# EAGLE design Top_PCB (EAGLE 9.7.0)
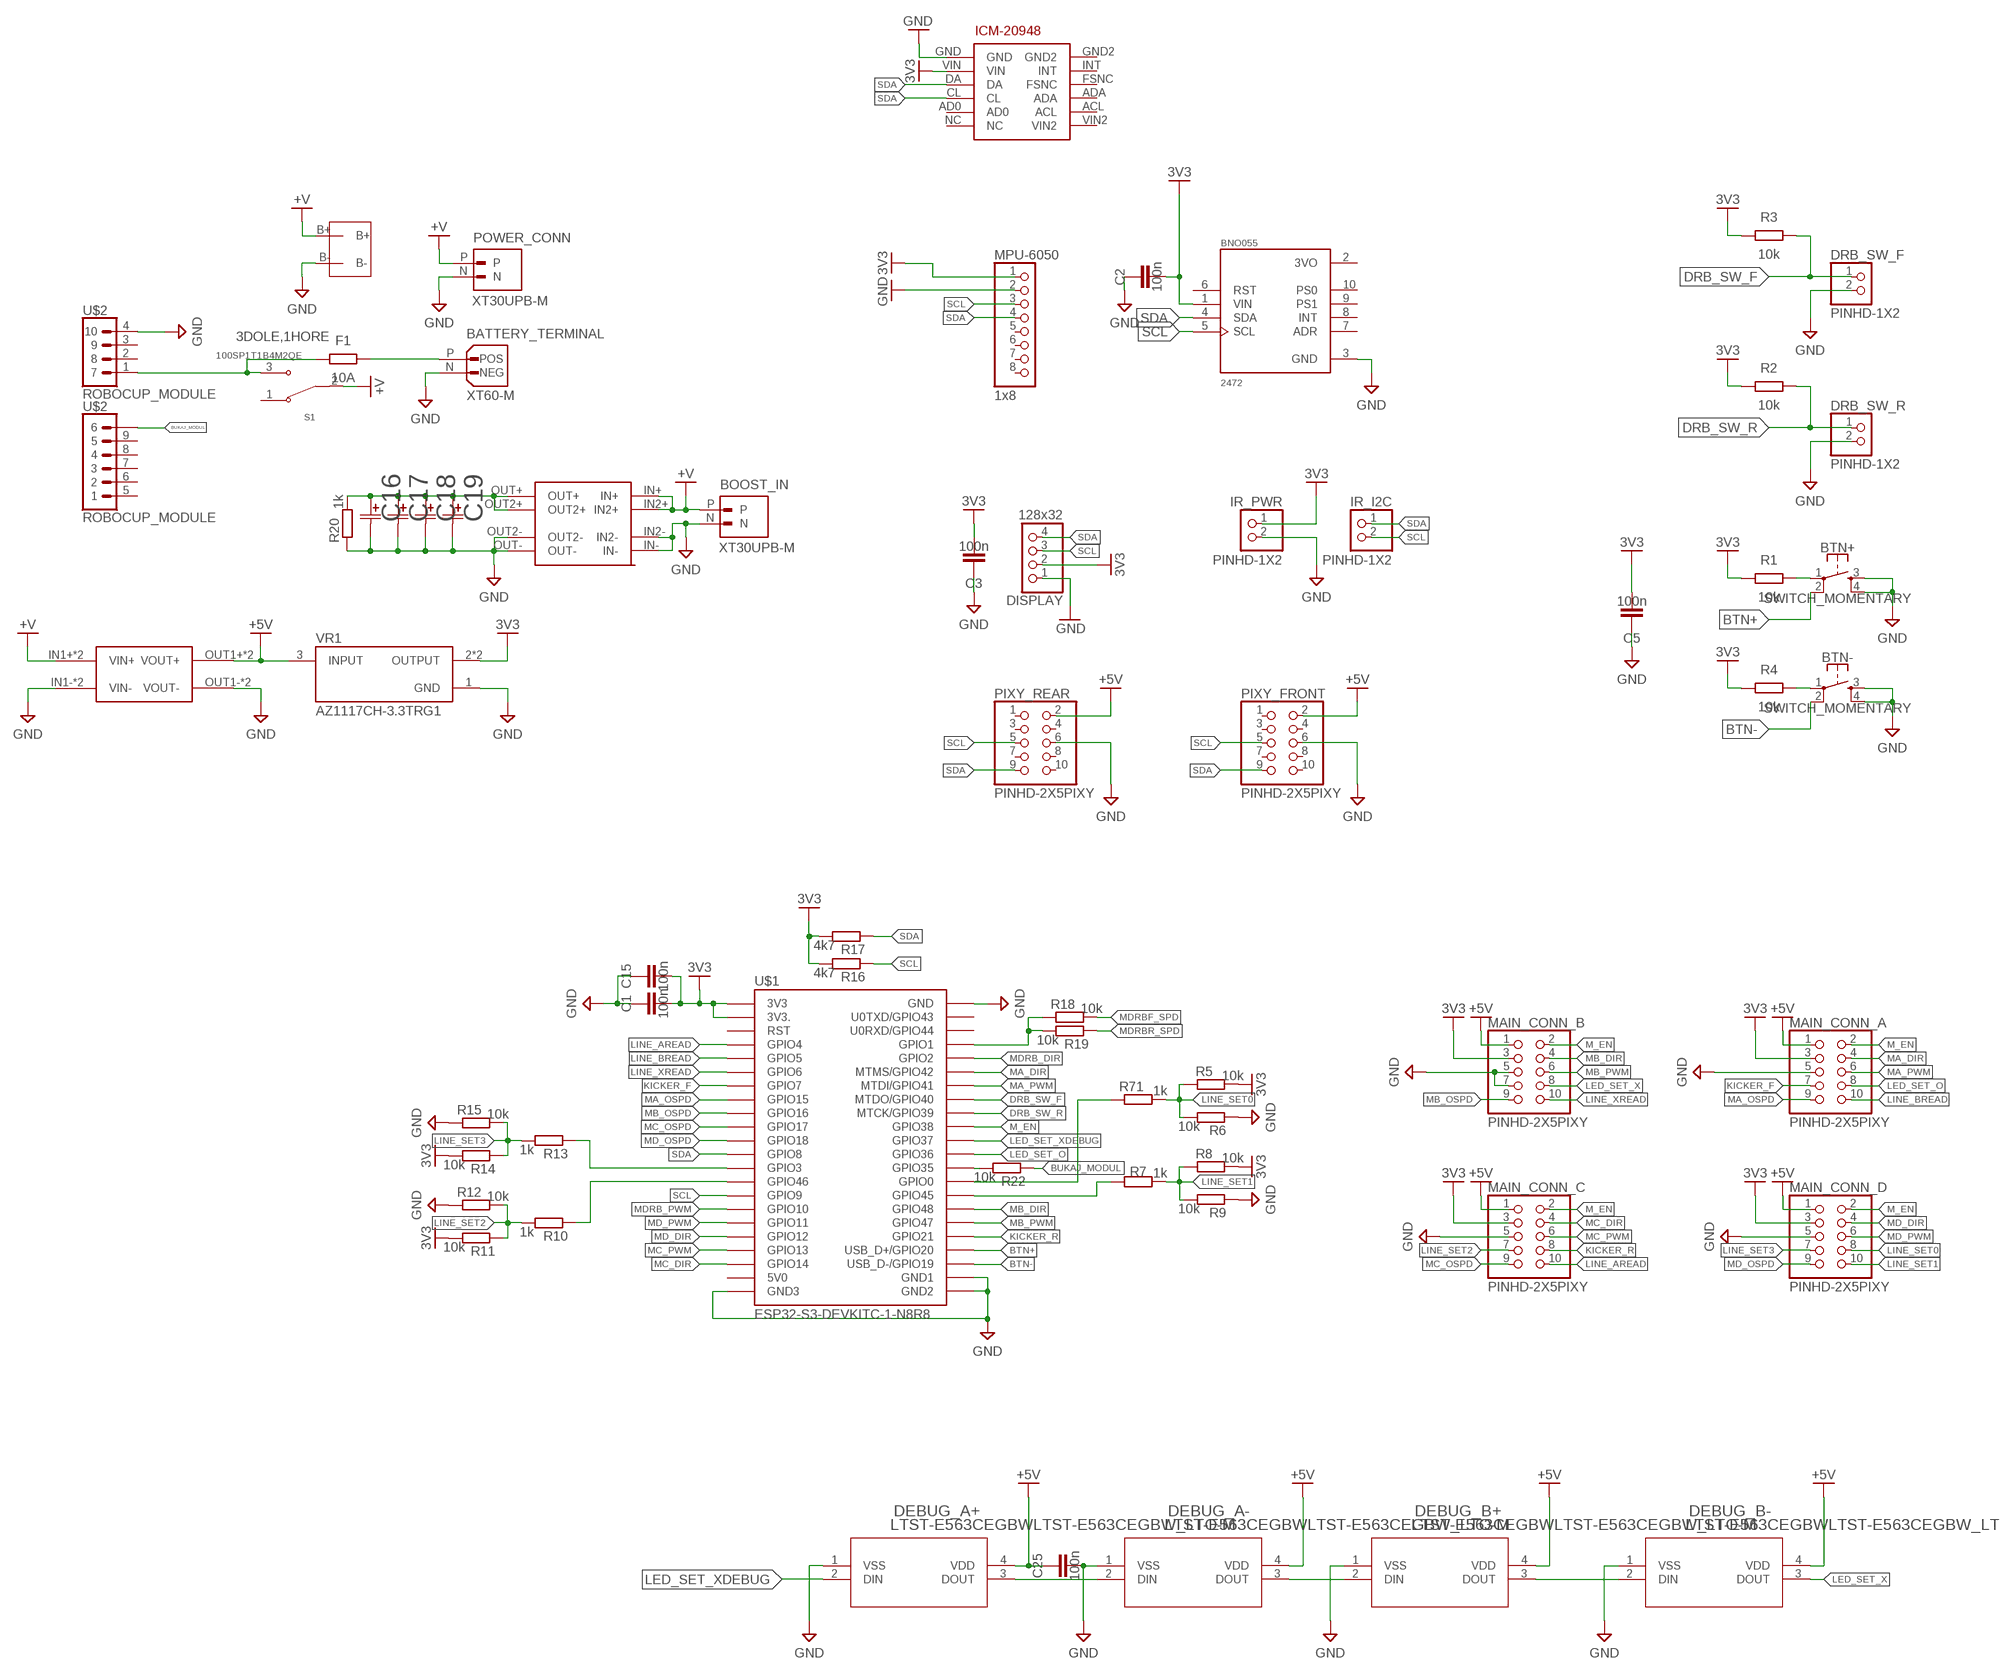
[diagram p0: schematic, sheet 1, part 1 of 2]
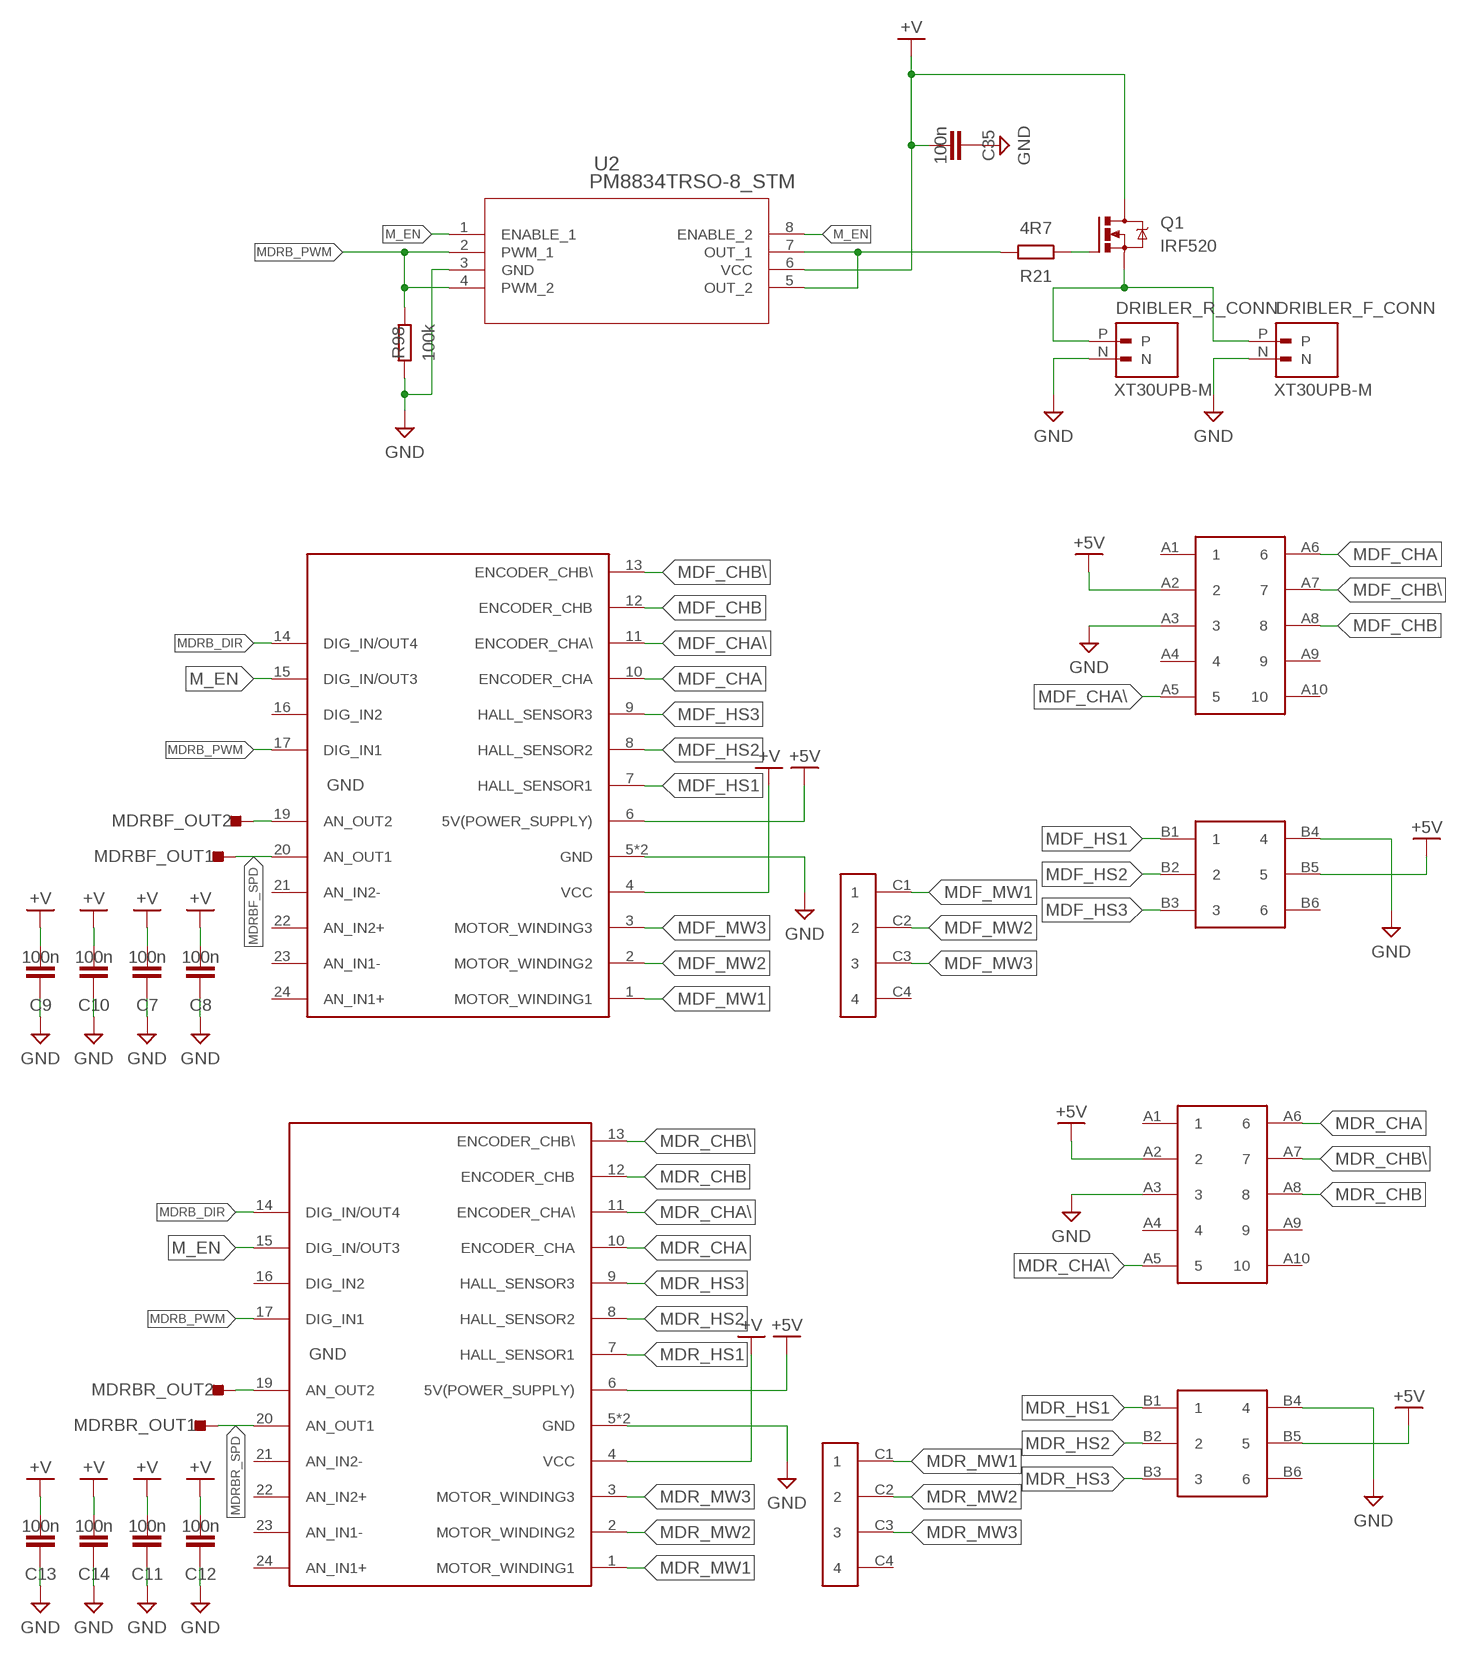
[diagram p1: schematic, sheet 1, part 2 of 2]

## Parts
BATT_VOLTAGE  BATT_V_METER  [1X02]
BATTERY_TERMINAL  XT60-M  [AMASS_XT60-M]
BNO055  2472  [MODULE_2472]
BOOST_IN  XT30UPB-M  [AMASS_XT30UPB-M]
BTN+  SWITCH_MOMENTARY  [SWITCH-MOMENTARY-PTH-6.5MM]
BTN-  SWITCH_MOMENTARY  [SWITCH-MOMENTARY-PTH-6.5MM]
C1  100n  C_CHIP-0805(2012-METRIC)  [CAPC2012X110]
C2  100n  C_CHIP-0805(2012-METRIC)  [CAPC2012X110]
C3  100n  C_CHIP-0805(2012-METRIC)  [CAPC2012X110]
C5  100n  C_CHIP-0805(2012-METRIC)  [CAPC2012X110]
C7  100n  C_CHIP-0805(2012-METRIC)  [CAPC2012X110]
C8  100n  C_CHIP-0805(2012-METRIC)  [CAPC2012X110]
C9  100n  C_CHIP-0805(2012-METRIC)  [CAPC2012X110]
C10  100n  C_CHIP-0805(2012-METRIC)  [CAPC2012X110]
C11  100n  C_CHIP-0805(2012-METRIC)  [CAPC2012X110]
C12  100n  C_CHIP-0805(2012-METRIC)  [CAPC2012X110]
C13  100n  C_CHIP-0805(2012-METRIC)  [CAPC2012X110]
C14  100n  C_CHIP-0805(2012-METRIC)  [CAPC2012X110]
C15  100n  C_CHIP-0805(2012-METRIC)  [CAPC2012X110]
C16  1mF  108CKE063MCAP_108CKE_ILC  [CAP_108CKE_ILC]
C17  1mF  108CKE063MCAP_108CKE_ILC  [CAP_108CKE_ILC]
C18  1mF  108CKE063MCAP_108CKE_ILC  [CAP_108CKE_ILC]
C19  1mF  108CKE063MCAP_108CKE_ILC  [CAP_108CKE_ILC]
C25  100n  C_CHIP-0805(2012-METRIC)  [CAPC2012X110]
C35  100n  C_CHIP-0805(2012-METRIC)  [CAPC2012X110]
DEBUG_A+  LTST-E563CEGBWLTST-E563CEGBW_LTO-M  [LTST-E563CEGBW_LTO-M]
DEBUG_A-  LTST-E563CEGBWLTST-E563CEGBW_LTO-M  [LTST-E563CEGBW_LTO-M]
DEBUG_B+  LTST-E563CEGBWLTST-E563CEGBW_LTO-M  [LTST-E563CEGBW_LTO-M]
DEBUG_B-  LTST-E563CEGBWLTST-E563CEGBW_LTO-M  [LTST-E563CEGBW_LTO-M]
DISPLAY  128x32  PINHD-1X4  [1X04]
DRB_SW_F  PINHD-1X2  [1X02]
DRB_SW_R  PINHD-1X2  [1X02]
DRIBLER_F_CONN  XT30UPB-M  [AMASS_XT30UPB-M]
DRIBLER_R_CONN  XT30UPB-M  [AMASS_XT30UPB-M]
F1  10A  R_CHIP-1206(3216-METRIC)  [RESC3216X70]
ICM-20948  ICM-20948  [ICM-20948]
IR_I2C  PINHD-1X2  [1X02]
IR_PWR  PINHD-1X2  [1X02]
MAIN_CONN_A  PINHD-2X5PIXY  [2X05]
MAIN_CONN_B  PINHD-2X5PIXY  [2X05]
MAIN_CONN_C  PINHD-2X5PIXY  [2X05]
MAIN_CONN_D  PINHD-2X5PIXY  [2X05]
MDRBF_OUT1  TESTPOINT_TPS-PAD-036  [TESTPOINT_PAD-036]
MDRBF_OUT2  TESTPOINT_TPS-PAD-036  [TESTPOINT_PAD-036]
MDRBR_OUT1  TESTPOINT_TPS-PAD-036  [TESTPOINT_PAD-036]
MDRBR_OUT2  TESTPOINT_TPS-PAD-036  [TESTPOINT_PAD-036]
MPU-6050  1x8  PINHD-1X8  [1X08]
PIXY_FRONT  PINHD-2X5PIXY  [2X05]
PIXY_REAR  PINHD-2X5PIXY  [2X05]
POWER_CONN  XT30UPB-M  [AMASS_XT30UPB-M]
Q1  IRF520  NMOSFET_IRF520_TO220  [TO220BV]
R1  10k  R_CHIP-0805(2012-METRIC)  [RESC2012X65]
R2  10k  R_CHIP-0805(2012-METRIC)  [RESC2012X65]
R3  10k  R_CHIP-0805(2012-METRIC)  [RESC2012X65]
R4  10k  R_CHIP-0805(2012-METRIC)  [RESC2012X65]
R5  10k  R_CHIP-0805(2012-METRIC)  [RESC2012X65]
R6  10k  R_CHIP-0805(2012-METRIC)  [RESC2012X65]
R7  1k  R_CHIP-0805(2012-METRIC)  [RESC2012X65]
R8  10k  R_CHIP-0805(2012-METRIC)  [RESC2012X65]
R9  10k  R_CHIP-0805(2012-METRIC)  [RESC2012X65]
R10  1k  R_CHIP-0805(2012-METRIC)  [RESC2012X65]
R11  10k  R_CHIP-0805(2012-METRIC)  [RESC2012X65]
R12  10k  R_CHIP-0805(2012-METRIC)  [RESC2012X65]
R13  1k  R_CHIP-0805(2012-METRIC)  [RESC2012X65]
R14  10k  R_CHIP-0805(2012-METRIC)  [RESC2012X65]
R15  10k  R_CHIP-0805(2012-METRIC)  [RESC2012X65]
R16  4k7  R_CHIP-0805(2012-METRIC)  [RESC2012X65]
R17  4k7  R_CHIP-0805(2012-METRIC)  [RESC2012X65]
R18  10k  R_CHIP-0805(2012-METRIC)  [RESC2012X65]
R19  10k  R_CHIP-0805(2012-METRIC)  [RESC2012X65]
R20  1k  R_CHIP-0805(2012-METRIC)  [RESC2012X65]
R21  4R7  R_CHIP-0805(2012-METRIC)  [RESC2012X65]
R22  10k  R_CHIP-0805(2012-METRIC)  [RESC2012X65]
R71  1k  R_CHIP-0805(2012-METRIC)  [RESC2012X65]
R98  100k  R_CHIP-0805(2012-METRIC)  [RESC2012X65]
S1  100SP1T1B4M2QE  [SW_100SP1T1B4M2QE]
U2  PM8834TRSO-8_STM  [SO-8_STM]
U$1  ESP32-S3-DEVKITC-1-N8R8  [ESP32-S3-DEVKITC-1-N8R8]
U$2  ROBOCUP_MODULE  [ROBOCUP_MODULE]
U$4  MP1584  [DC-BRICK]
U$5  BOOST  [BOOST]
U$7  ESCON24/224/2  [ESCON24/2]
U$8  PIN2.54-2X5  [PIN2.54-2X5]
U$9  ESCON24/224/2  [ESCON24/2]
U$10  MX-44914-0601  [MX-44914-0601]
U$11  PIN2.54-2X5  [PIN2.54-2X5]
U$12  MX-44914-0601  [MX-44914-0601]
U$13  MX5566  [MX5566]
U$14  MX5566  [MX5566]
VR1  AZ1117CH-3.3TRG1  [VREG_AZ1117CH-3.3TRG1]

## Nets
3DOLE,1HORE: F1.1 S1.3 U$2.1
3V3: BNO055.1(VIN) C1.2 C2.2 C3.2 C5.2 C15.2 DISPLAY.2 ICM-20948.VIN IR_PWR.1 MAIN_CONN_A.3 MAIN_CONN_B.3 MAIN_CONN_C.3 MAIN_CONN_D.3 MPU-6050.1 R1.1 R2.1 R3.1 R4.1 R5.1 R8.1 R11.1 R14.1 R16.1 R17.1 U$1.J1_1(3V3) U$1.J1_2(3V3.) VR1.2(OUTPUT) VR1.4(OUTPUT)
+5V: C25.1 DEBUG_A+.4(VDD) DEBUG_A-.4(VDD) DEBUG_B+.4(VDD) DEBUG_B-.4(VDD) MAIN_CONN_A.1 MAIN_CONN_B.1 MAIN_CONN_C.1 MAIN_CONN_D.1 PIXY_FRONT.2 PIXY_REAR.2 U$4.OUT1+(VOUT+) U$4.OUT2+(VOUT+) U$7.6(5V(POWER_SUPPLY)) U$8.A2 U$9.6(5V(POWER_SUPPLY)) U$10.B5 U$11.A2 U$12.B5 VR1.3(INPUT)
+V: BATT_VOLTAGE.B+ BOOST_IN.P C7.2 C8.2 C9.2 C10.2 C11.2 C12.2 C13.2 C14.2 C35.2 POWER_CONN.P Q1.D S1.2 U2.6(VCC) U$4.IN1+(VIN+) U$4.IN2+(VIN+) U$5.IN2+ U$5.IN+ U$7.4(VCC) U$9.4(VCC)
BTN+: BTN+.2 U$1.J3_19(USB_D+/GPIO20)
BTN-: BTN-.2 U$1.J3_20(USB_D-/GPIO19)
BUKAJ_MODUL: R22.2 U$2.10
DRB_SW_F: DRB_SW_F.1 R3.2 U$1.J3_8(MTDO/GPIO40)
DRB_SW_R: DRB_SW_R.1 R2.2 U$1.J3_9(MTCK/GPIO39)
GND: BATT_VOLTAGE.B- BATTERY_TERMINAL.N(NEG) BNO055.3(GND) BOOST_IN.N BTN+.3 BTN+.4 BTN-.3 BTN-.4 C1.1 C2.1 C3.1 C5.1 C7.1 C8.1 C9.1 C10.1 C11.1 C12.1 C13.1 C14.1 C15.1 C16.2 C17.2 C18.2 C19.2 C25.2 C35.1 DEBUG_A+.1(VSS) DEBUG_A-.1(VSS) DEBUG_B+.1(VSS) DEBUG_B-.1(VSS) DISPLAY.1 DRB_SW_F.2 DRB_SW_R.2 DRIBLER_F_CONN.N DRIBLER_R_CONN.N ICM-20948.GND IR_PWR.2 MAIN_CONN_A.5 MAIN_CONN_B.5 MAIN_CONN_B.7 MAIN_CONN_C.5 MAIN_CONN_D.5 MPU-6050.2 PIXY_FRONT.6 PIXY_REAR.6 POWER_CONN.N R6.2 R9.2 R12.2 R15.2 R20.2 R98.1 U2.3(GND) U$1.J1_22(GND3) U$1.J3_1(GND) U$1.J3_21(GND1) U$1.J3_22(GND2) U$2.4 U$4.IN1-(VIN-) U$4.IN2-(VIN-) U$4.OUT1-(VOUT-) U$4.OUT2-(VOUT-) U$5.IN2- U$5.IN- U$5.OUT2- U$5.OUT- U$7.5(GND) U$7.18(GND) U$8.A3 U$9.5(GND) U$9.18(GND) U$10.B4 U$11.A3 U$12.B4 VR1.1(GND)
KICKER_F: MAIN_CONN_A.7 U$1.J1_7(GPIO7)
KICKER_R: MAIN_CONN_C.8 U$1.J3_18(GPIO21)
LED_SET_DEBUG1: DEBUG_A-.3(DOUT) DEBUG_B+.2(DIN)
LED_SET_O: MAIN_CONN_A.8 U$1.J3_12(GPIO36)
LED_SET_X: DEBUG_B-.3(DOUT) MAIN_CONN_B.8
LED_SET_XDEBUG: DEBUG_A+.2(DIN) U$1.J3_11(GPIO37)
LINE_AREAD: MAIN_CONN_C.10 U$1.J1_4(GPIO4)
LINE_BREAD: MAIN_CONN_A.10 U$1.J1_5(GPIO5)
LINE_SET0: MAIN_CONN_D.8 R5.2 R6.1 R71.1
LINE_SET1: MAIN_CONN_D.10 R7.1 R8.2 R9.1
LINE_SET2: MAIN_CONN_C.7 R10.1 R11.2 R12.1
LINE_SET3: MAIN_CONN_D.7 R13.1 R14.2 R15.1
LINE_XREAD: MAIN_CONN_B.10 U$1.J1_6(GPIO6)
M_EN: MAIN_CONN_A.2 MAIN_CONN_B.2 MAIN_CONN_C.2 MAIN_CONN_D.2 U2.1(ENABLE_1) U2.8(ENABLE_2) U$1.J3_10(GPIO38) U$7.15(DIG_IN/OUT3) U$9.15(DIG_IN/OUT3)
MA_DIR: MAIN_CONN_A.4 U$1.J3_6(MTMS/GPIO42)
MA_OSPD: MAIN_CONN_A.9 U$1.J1_8(GPIO15)
MA_PWM: MAIN_CONN_A.6 U$1.J3_7(MTDI/GPIO41)
MB_DIR: MAIN_CONN_B.4 U$1.J3_16(GPIO48)
MB_OSPD: MAIN_CONN_B.9 U$1.J1_9(GPIO16)
MB_PWM: MAIN_CONN_B.6 U$1.J3_17(GPIO47)
MC_DIR: MAIN_CONN_C.4 U$1.J1_20(GPIO14)
MC_OSPD: MAIN_CONN_C.9 U$1.J1_10(GPIO17)
MC_PWM: MAIN_CONN_C.6 U$1.J1_19(GPIO13)
MD_DIR: MAIN_CONN_D.4 U$1.J1_18(GPIO12)
MD_OSPD: MAIN_CONN_D.9 U$1.J1_11(GPIO18)
MD_PWM: MAIN_CONN_D.6 U$1.J1_17(GPIO11)
MDF_CHA: U$9.10(ENCODER_CHA) U$11.A6
MDF_CHA\\: U$9.11(ENCODER_CHA\\) U$11.A5
MDF_CHB: U$9.12(ENCODER_CHB) U$11.A8
MDF_CHB\\: U$9.13(ENCODER_CHB\\) U$11.A7
MDF_HS1: U$9.7(HALL_SENSOR1) U$12.B1
MDF_HS2: U$9.8(HALL_SENSOR2) U$12.B2
MDF_HS3: U$9.9(HALL_SENSOR3) U$12.B3
MDF_MW1: U$9.1(MOTOR_WINDING1) U$13.C1
MDF_MW2: U$9.2(MOTOR_WINDING2) U$13.C2
MDF_MW3: U$9.3(MOTOR_WINDING3) U$13.C3
MDR_CHA: U$7.10(ENCODER_CHA) U$8.A6
MDR_CHA\\: U$7.11(ENCODER_CHA\\) U$8.A5
MDR_CHB: U$7.12(ENCODER_CHB) U$8.A8
MDR_CHB\\: U$7.13(ENCODER_CHB\\) U$8.A7
MDR_HS1: U$7.7(HALL_SENSOR1) U$10.B1
MDR_HS2: U$7.8(HALL_SENSOR2) U$10.B2
MDR_HS3: U$7.9(HALL_SENSOR3) U$10.B3
MDR_MW1: U$7.1(MOTOR_WINDING1) U$14.C1
MDR_MW2: U$7.2(MOTOR_WINDING2) U$14.C2
MDR_MW3: U$7.3(MOTOR_WINDING3) U$14.C3
MDRB_DIR: U$1.J3_5(GPIO2) U$7.14(DIG_IN/OUT4) U$9.14(DIG_IN/OUT4)
MDRB_PWM: R98.2 U2.2(PWM_1) U2.4(PWM_2) U$1.J1_16(GPIO10) U$7.17(DIG_IN1) U$9.17(DIG_IN1)
MDRB_SPD: R18.2 R19.1 U$1.J3_4(GPIO1)
MDRBF_SPD: MDRBF_OUT1.1(TP) R18.1 U$9.20(AN_OUT1)
MDRBR_SPD: MDRBR_OUT1.1(TP) R19.2 U$7.20(AN_OUT1)
N$1: DEBUG_B+.3(DOUT) DEBUG_B-.2(DIN)
N$2: C16.1 C17.1 C18.1 C19.1 R20.1 U$5.OUT2+ U$5.OUT+
N$3: BATTERY_TERMINAL.P(POS) F1.2
N$4: Q1.G R21.1
N$6: R22.1 U$1.J3_13(GPIO35)
N$10: BTN+.1 R1.2
N$11: MDRBR_OUT2.1(TP) U$7.19(AN_OUT2)
N$13: BTN-.1 R4.2
N$15: R13.2 U$1.J1_13(GPIO3)
N$16: R71.2 U$1.J3_14(GPIO0)
N$24: DEBUG_A+.3(DOUT) DEBUG_A-.2(DIN)
N$32: DRIBLER_F_CONN.P DRIBLER_R_CONN.P Q1.S
N$35: R10.2 U$1.J1_14(GPIO46)
N$36: R7.2 U$1.J3_15(GPIO45)
N$51: R21.2 U2.5(OUT_2) U2.7(OUT_1)
N$52: MDRBF_OUT2.1(TP) U$9.19(AN_OUT2)
SCL: BNO055.5(SCL) DISPLAY.3 IR_I2C.2 MPU-6050.3 PIXY_FRONT.5 PIXY_REAR.5 R16.2 U$1.J1_15(GPIO9)
SDA: BNO055.4(SDA) DISPLAY.4 ICM-20948.CL ICM-20948.DA IR_I2C.1 MPU-6050.4 PIXY_FRONT.9 PIXY_REAR.9 R17.2 U$1.J1_12(GPIO8)
Unconnected: BNO055.6(RST) BNO055.7(ADR) BNO055.8(INT) BNO055.9(PS1) BNO055.10(PS0) ICM-20948.ACL ICM-20948.AD0 ICM-20948.ADA ICM-20948.FSNC ICM-20948.GND2 ICM-20948.INT ICM-20948.NC ICM-20948.VIN2 MPU-6050.5 MPU-6050.6 MPU-6050.7 MPU-6050.8 PIXY_FRONT.1 PIXY_FRONT.3 PIXY_FRONT.4 PIXY_FRONT.7 PIXY_FRONT.8 PIXY_FRONT.10 PIXY_REAR.1 PIXY_REAR.3 PIXY_REAR.4 PIXY_REAR.7 PIXY_REAR.8 PIXY_REAR.10 S1.1 U$1.J1_3(RST) U$1.J3_2(U0TXD/GPIO43) U$1.J3_3(U0RXD/GPIO44) U$2.2 U$2.3 U$2.5 U$2.6 U$2.7 U$2.8 U$2.9 U$7.16(DIG_IN2) U$7.21(AN_IN2-) U$7.22(AN_IN2+) U$7.23(AN_IN1-) U$7.24(AN_IN1+) U$8.A1 U$8.A4 U$8.A9 U$8.A10 U$9.16(DIG_IN2) U$9.21(AN_IN2-) U$9.22(AN_IN2+) U$9.23(AN_IN1-) U$9.24(AN_IN1+) U$10.B6 U$11.A1 U$11.A4 U$11.A9 U$11.A10 U$12.B6 U$13.C4 U$14.C4

## Power pins joined to a net without a drawn wire
3VO: BNO055.2(3VO)
5V0: U$1.J1_21(5V0)

## Library data of the parts
BATT_VOLTAGE = BATT_V_METER:BATT_V_METER
BATTERY_TERMINAL = XT60-M:XT60-M: Check availability <https://pricing.snapeda.com/parts/XT60-M/AMASS/view-part?ref=eda>; AVAILABILITY: In Stock; CHECK_PRICES: https://www.snapeda.com/parts/XT60-M/AMASS/view-part/?ref=eda; DESCRIPTION: Plug; DC supply; XT60; male; PIN: 2; for cable; soldered; 30A; 500V; MF: AMASS; MP: XT60-M; PACKAGE: Package; PRICE: None; SNAPEDA_LINK: https://www.snapeda.com/parts/XT60-M/AMASS/view-part/?ref=snap
BNO055 = 2472:2472: Check availability <https://pricing.snapeda.com/parts/2472/Adafruit/view-part?ref=eda>; AVAILABILITY: In Stock; CHECK_PRICES: https://www.snapeda.com/parts/2472/Adafruit+Industries/view-part/?ref=eda; DESCRIPTION: Adafruit 9-DOF Absolute Orientation IMU Fusion Breakout - BNO055 | Adafruit Industries 2472; MF: Adafruit; MP: 2472; PACKAGE: Non-Standard Adafruit; PRICE: None; PURCHASE-URL: https://www.snapeda.com/api/url_track_click_mouser/?unipart_id=6348449&manufacturer=Adafruit&part_name=2472&search_term=adafruit 9-dof; SNAPEDA_LINK: https://www.snapeda.com/parts/2472/Adafruit+Industries/view-part/?ref=snap
BOOST_IN DRIBLER_F_CONN DRIBLER_R_CONN POWER_CONN = XT30UPB-M:XT30UPB-M: Check availability <https://pricing.snapeda.com/parts/XT30UPB-M/amass/view-part?ref=eda>; AVAILABILITY: In Stock; CHECK_PRICES: https://www.snapeda.com/parts/XT30UPB-M/AMASS/view-part/?ref=eda; DESCRIPTION: Socket; DC supply; XT30; male; PIN: 2; on PCBs; THT; yellow; 15A; 500V; MF: amass; MP: XT30UPB-M; PACKAGE: None; PRICE: None; SNAPEDA_LINK: https://www.snapeda.com/parts/XT30UPB-M/AMASS/view-part/?ref=snap
BTN+ BTN- = Tinkercad:SWITCH_MOMENTARY
C1-C3 C5 C7-C15 C25 C35 = Capacitor:C: Capacitor - Generic; CATEGORY: Capacitor
C16-C19 = 2026-02-10_19-56-46_Library:108CKE063M; COPYRIGHT: Copyright (C) 2026 Ultra Librarian. All rights reserved.; MANUFACTURER_NAME: Cornell Dubilier; MANUFACTURER_PART_NUMBER: 108CKE063M; TYPE: Aluminum Electrolytic Capacitors
DEBUG_A+ DEBUG_A- DEBUG_B+ DEBUG_B- = 2025-12-23_15-34-03_Library:LTST-E563CEGBW; COPYRIGHT: Copyright (C) 2025 Ultra Librarian. All rights reserved.; MANUFACTURER_NAME: LITE-ON; MANUFACTURER_PART_NUMBER: LTST-E563CEGBW; TYPE: LED Addressable
DISPLAY = pinhead:PINHD-1X4: PIN HEADER
DRB_SW_F DRB_SW_R IR_I2C IR_PWR = Connector:PINHD-1X2: PIN HEADER; CATEGORY: Headers; DESCRIPTION: Header, Straight, 2 Position; MANUFACTURER: Generic; MPN: Generic; OPERATING_TEMPERATURE: Generic; PART_STATUS: Active; PITCH: 0.100" (2.54mm); ROHS_COMPLIANCE: Generic; SERIES: Generic; SUB-CATEGORY: Headers, Male Pins; TYPE: Board to Board or Cable, Unshrouded, Through Hole, Straight
F1 R1-R22 R71 R98 = Resistor:R: Resistor Fixed - Generic; CATEGORY: Resistor; SUB-CATEGORY: Fixed
ICM-20948 = ICM-20948:ICM-20948
MAIN_CONN_A MAIN_CONN_B MAIN_CONN_C MAIN_CONN_D PIXY_FRONT PIXY_REAR = Connector:PINHD-2X5PIXY: PIN HEADER; CATEGORY: CONNECTOR; SUB-CATEGORY: PIN-HEADER
MDRBF_OUT1 MDRBF_OUT2 MDRBR_OUT1 MDRBR_OUT2 = LinkedLibrary52101:TESTPOINT_TPS: TEST POINT PAD; BOM: EXCLUDE
MPU-6050 = pinhead:PINHD-1X8: PIN HEADER
Q1 = Transistor:NMOSFET_: N-Channel MOSFET - Popular parts; CATEGORY: Transistor; DESCRIPTION: MOSFET N-CH 100V 9.7A TO-220AB; DRAIN_CURRENT: 9.7A; MANUFACTURER: Infineon Technologies; MPN: IRF520NPBF; OPERATING_TEMP: -55°C ~ 175°C; PART_STATUS: Active; ROHS_COMPLIANT: Yes; SUB-CATEGORY: MOSFET; THERMALLOSS: 48W; TYPE: N-Channel
S1 = 100SP1T1B4M2QE:100SP1T1B4M2QE; MANUFACTURER: E-Switch; MAXIMUM_PACKAGE_HEIGHT: 29.68 mm; PARTREV: E; STANDARD: Manufacturer Recommendations
U2 = 2025-12-28_13-06-10_Library:PM8834TR; COPYRIGHT: Copyright (C) 2025 Ultra Librarian. All rights reserved.; DATASHEET: https://www.st.com/resource/en/datasheet/pm8834.pdf; DESCRIPTION: 4 A dual low side MOSFET driver; MANUFACTURER_NAME: STMicroelectronics; MANUFACTURER_PART_NUMBER: PM8834TR
U$1 = ESP32-S3-DEVKITC-1-N8R8 (1):ESP32-S3-DEVKITC-1-N8R8: Check availability <https://pricing.snapeda.com/parts/ESP32-S3-DEVKITC-1-N8R8/Espressif%20Systems/view-part?ref=eda>; AVAILABILITY: In Stock; CHECK_PRICES: https://www.snapeda.com/parts/ESP32-S3-DEVKITC-1-N8R8/Espressif+Systems/view-part/?ref=eda; DESCRIPTION: The ESP32-S3-DEVKITC-1-N8R8 from Espressif Systems is a development board designed for RF, RFID, and wireless applications. It supports 802.11 b/g/n Wi-Fi and Bluetooth® 5.x (BLE) connectivity at 2.4GHz, making it ideal for IoT and wireless communication projects. This board is powered by the ESP32-S3-WROOM-1-N8R8 module, which features 8MB Quad SPI Flash and 8MB Octal SPI for efficient memory storage and processing.; MF: Espressif Systems; MP: ESP32-S3-DEVKITC-1-N8R8; PACKAGE: None; PRICE: None; PURCHASE-URL: https://www.snapeda.com/api/url_track_click_mouser/?unipart_id=8940048&manufacturer=Espressif Systems&part_name=ESP32-S3-DEVKITC-1-N8R8&search_term=esp32 s3; SNAPEDA_LINK: https://www.snapeda.com/parts/ESP32-S3-DEVKITC-1-N8R8/Espressif+Systems/view-part/?ref=snap; SPICEPREFIX: X
U$2 = ROBOCUP_MODULE:ROBOCUP_MODULE
U$4 = MP1584-dc-brick:MP1584: MP1584-dc-brick-pcb Step down Input: 4.5V - 28V Ouput 0.8V - 25V max. 3A Cheap on ebay
U$5 = BOOST:BOOST
U$7 U$9 = ESCON_24-2:ESCON24/2
U$8 U$11 = PIN2.54-2X5:PIN2.54-2X5: Connector for EC-FLAT45(encoder): Can be bought at gme.sk: https://www.gme.sk/v/1498388/kls-mlw10g-konektor-vidlice-roztec-254mm-2x5pinov-priama-do-dps
U$10 U$12 = MX-44914-0601:MX-44914-0601: Connector for EC-FLAT45(hall sensor): Can be bought trough tme.eu: https://www.tme.eu/gb/details/mx-44914-0601/other-connectors-molex/molex/449140601/
U$13 U$14 = MX5566:MX5566: Connector for EC-FLAT45(motor windings): Can be bought on gme.sk: https://www.gme.sk/v/1496575/molex-39-28-1043-mini-fit-vidlica-rozstup-42mm-2x2piny-priama-do-dps
VR1 = AZ1117CH-3.3TRG1:AZ1117CH-3.3TRG1; CREATOR: ASHISH; MANUFACTURER: Diodes Inc.; MAXIMUM_PACKAGE_HEIGHT: 1.8mm; PARTREV: 5 - 2; STANDARD: Manufacturer Recommendations

## Board
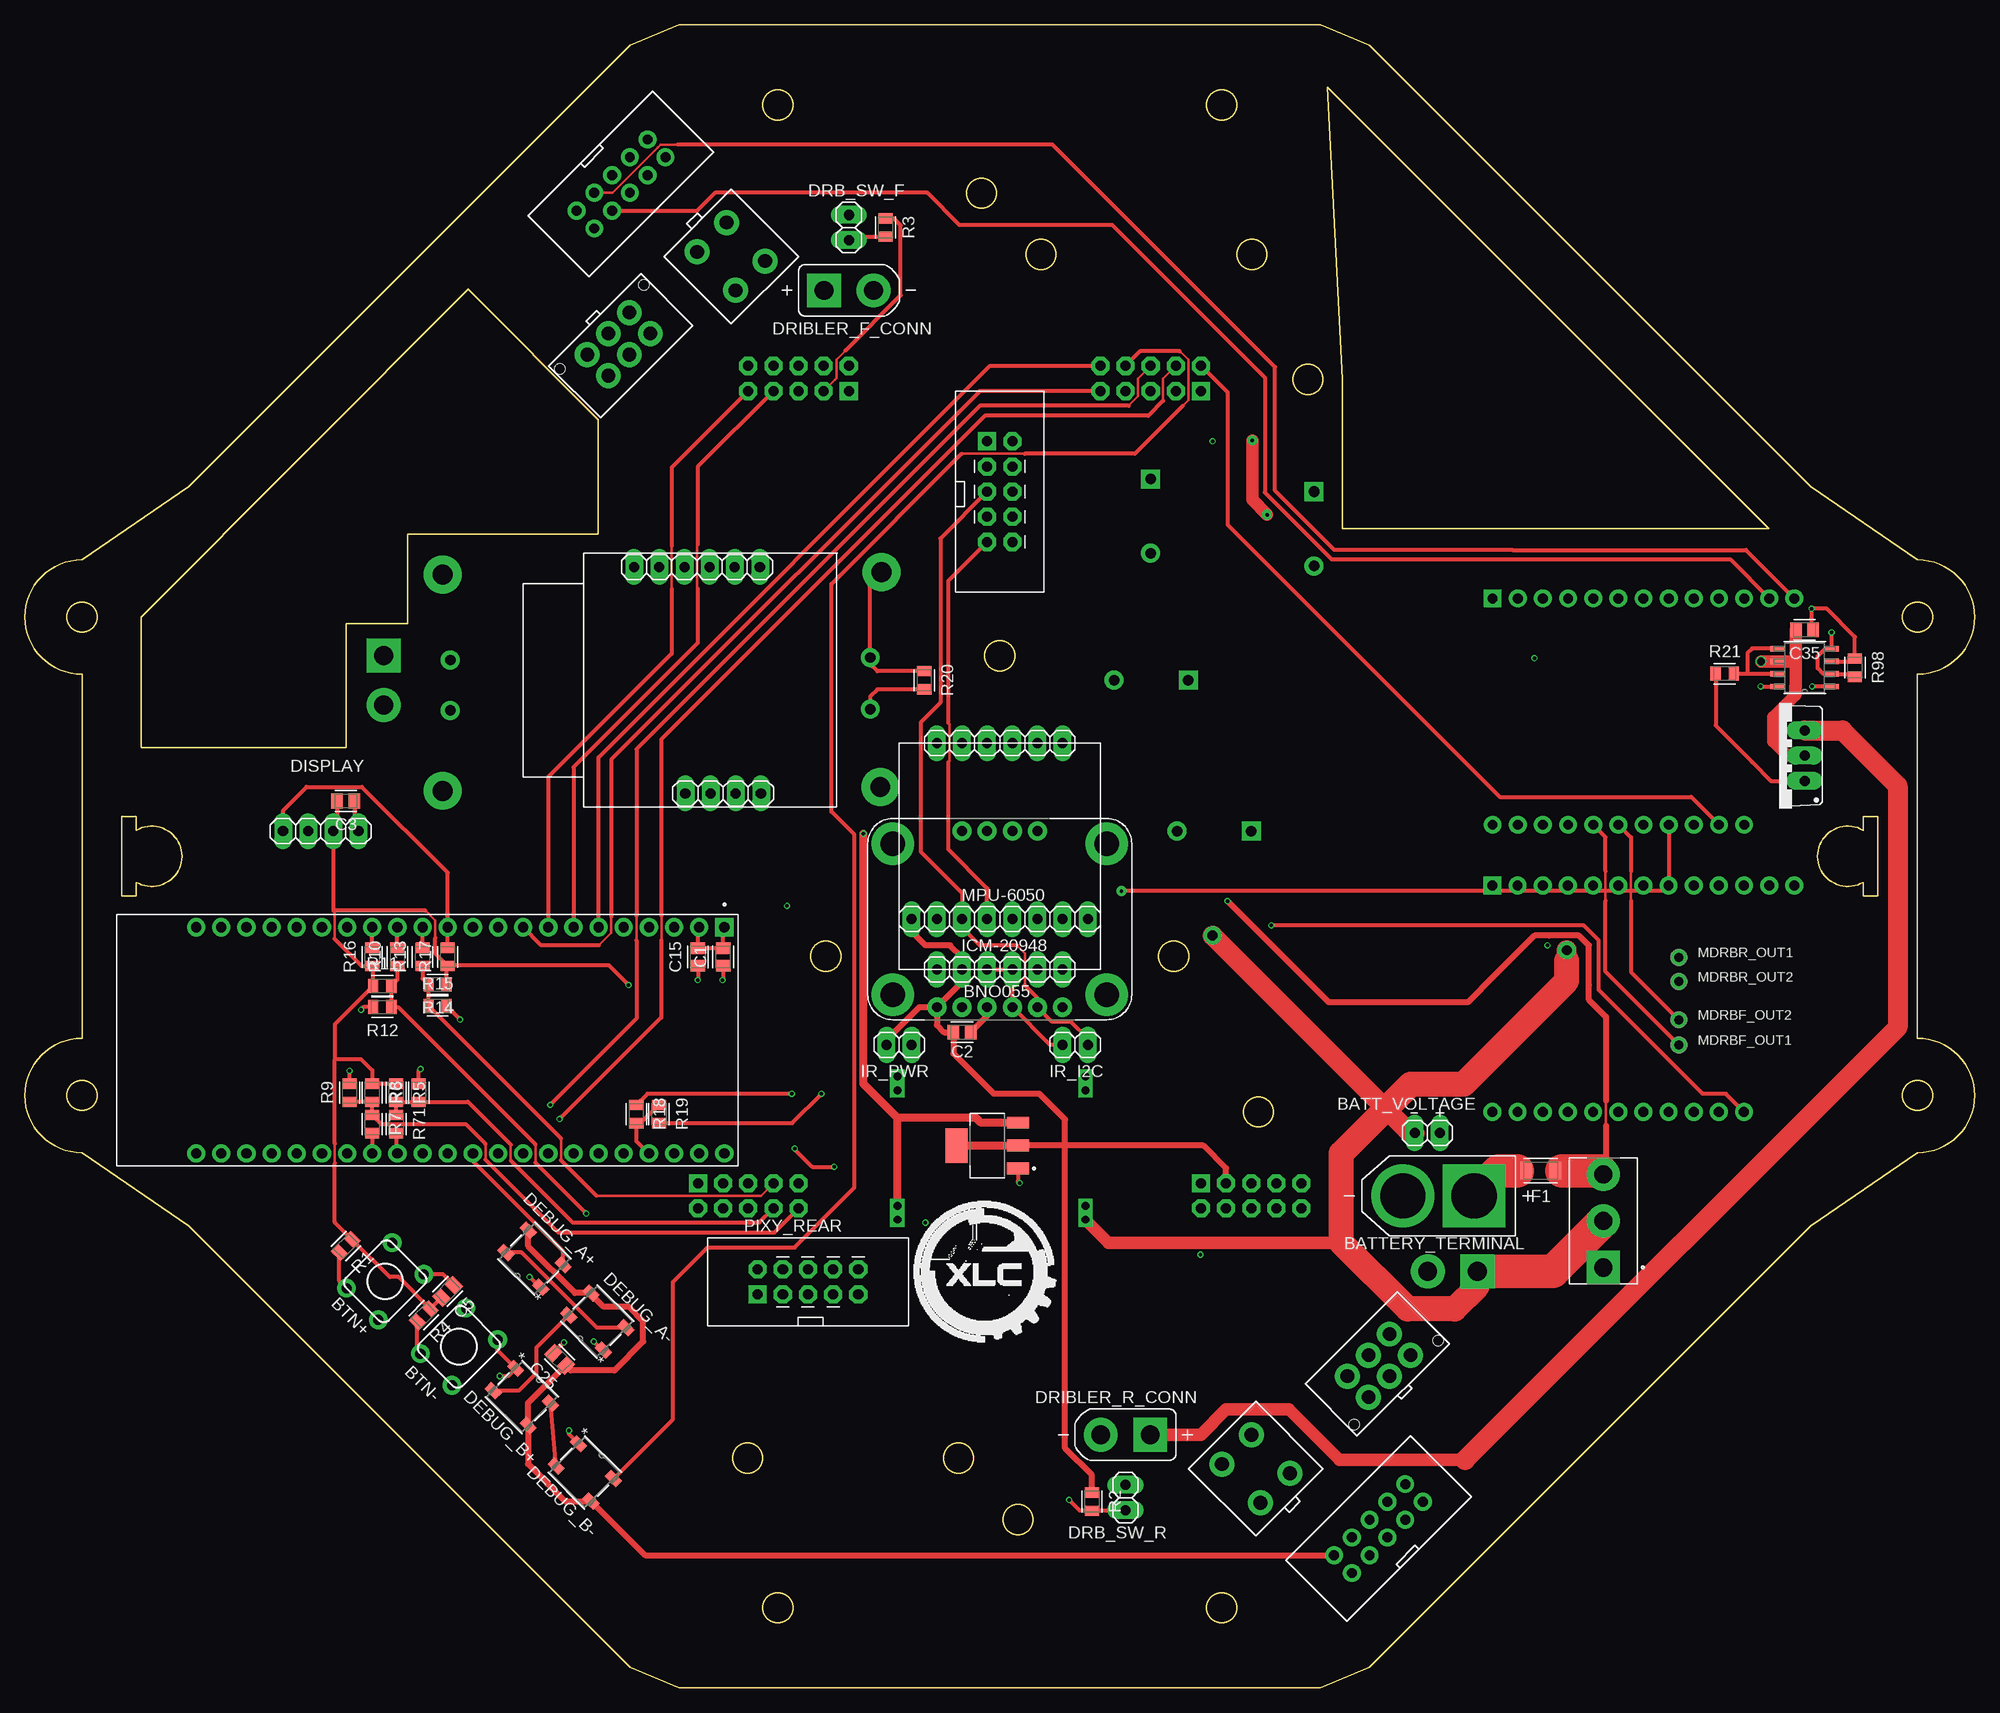
[diagram p2: board, top side]
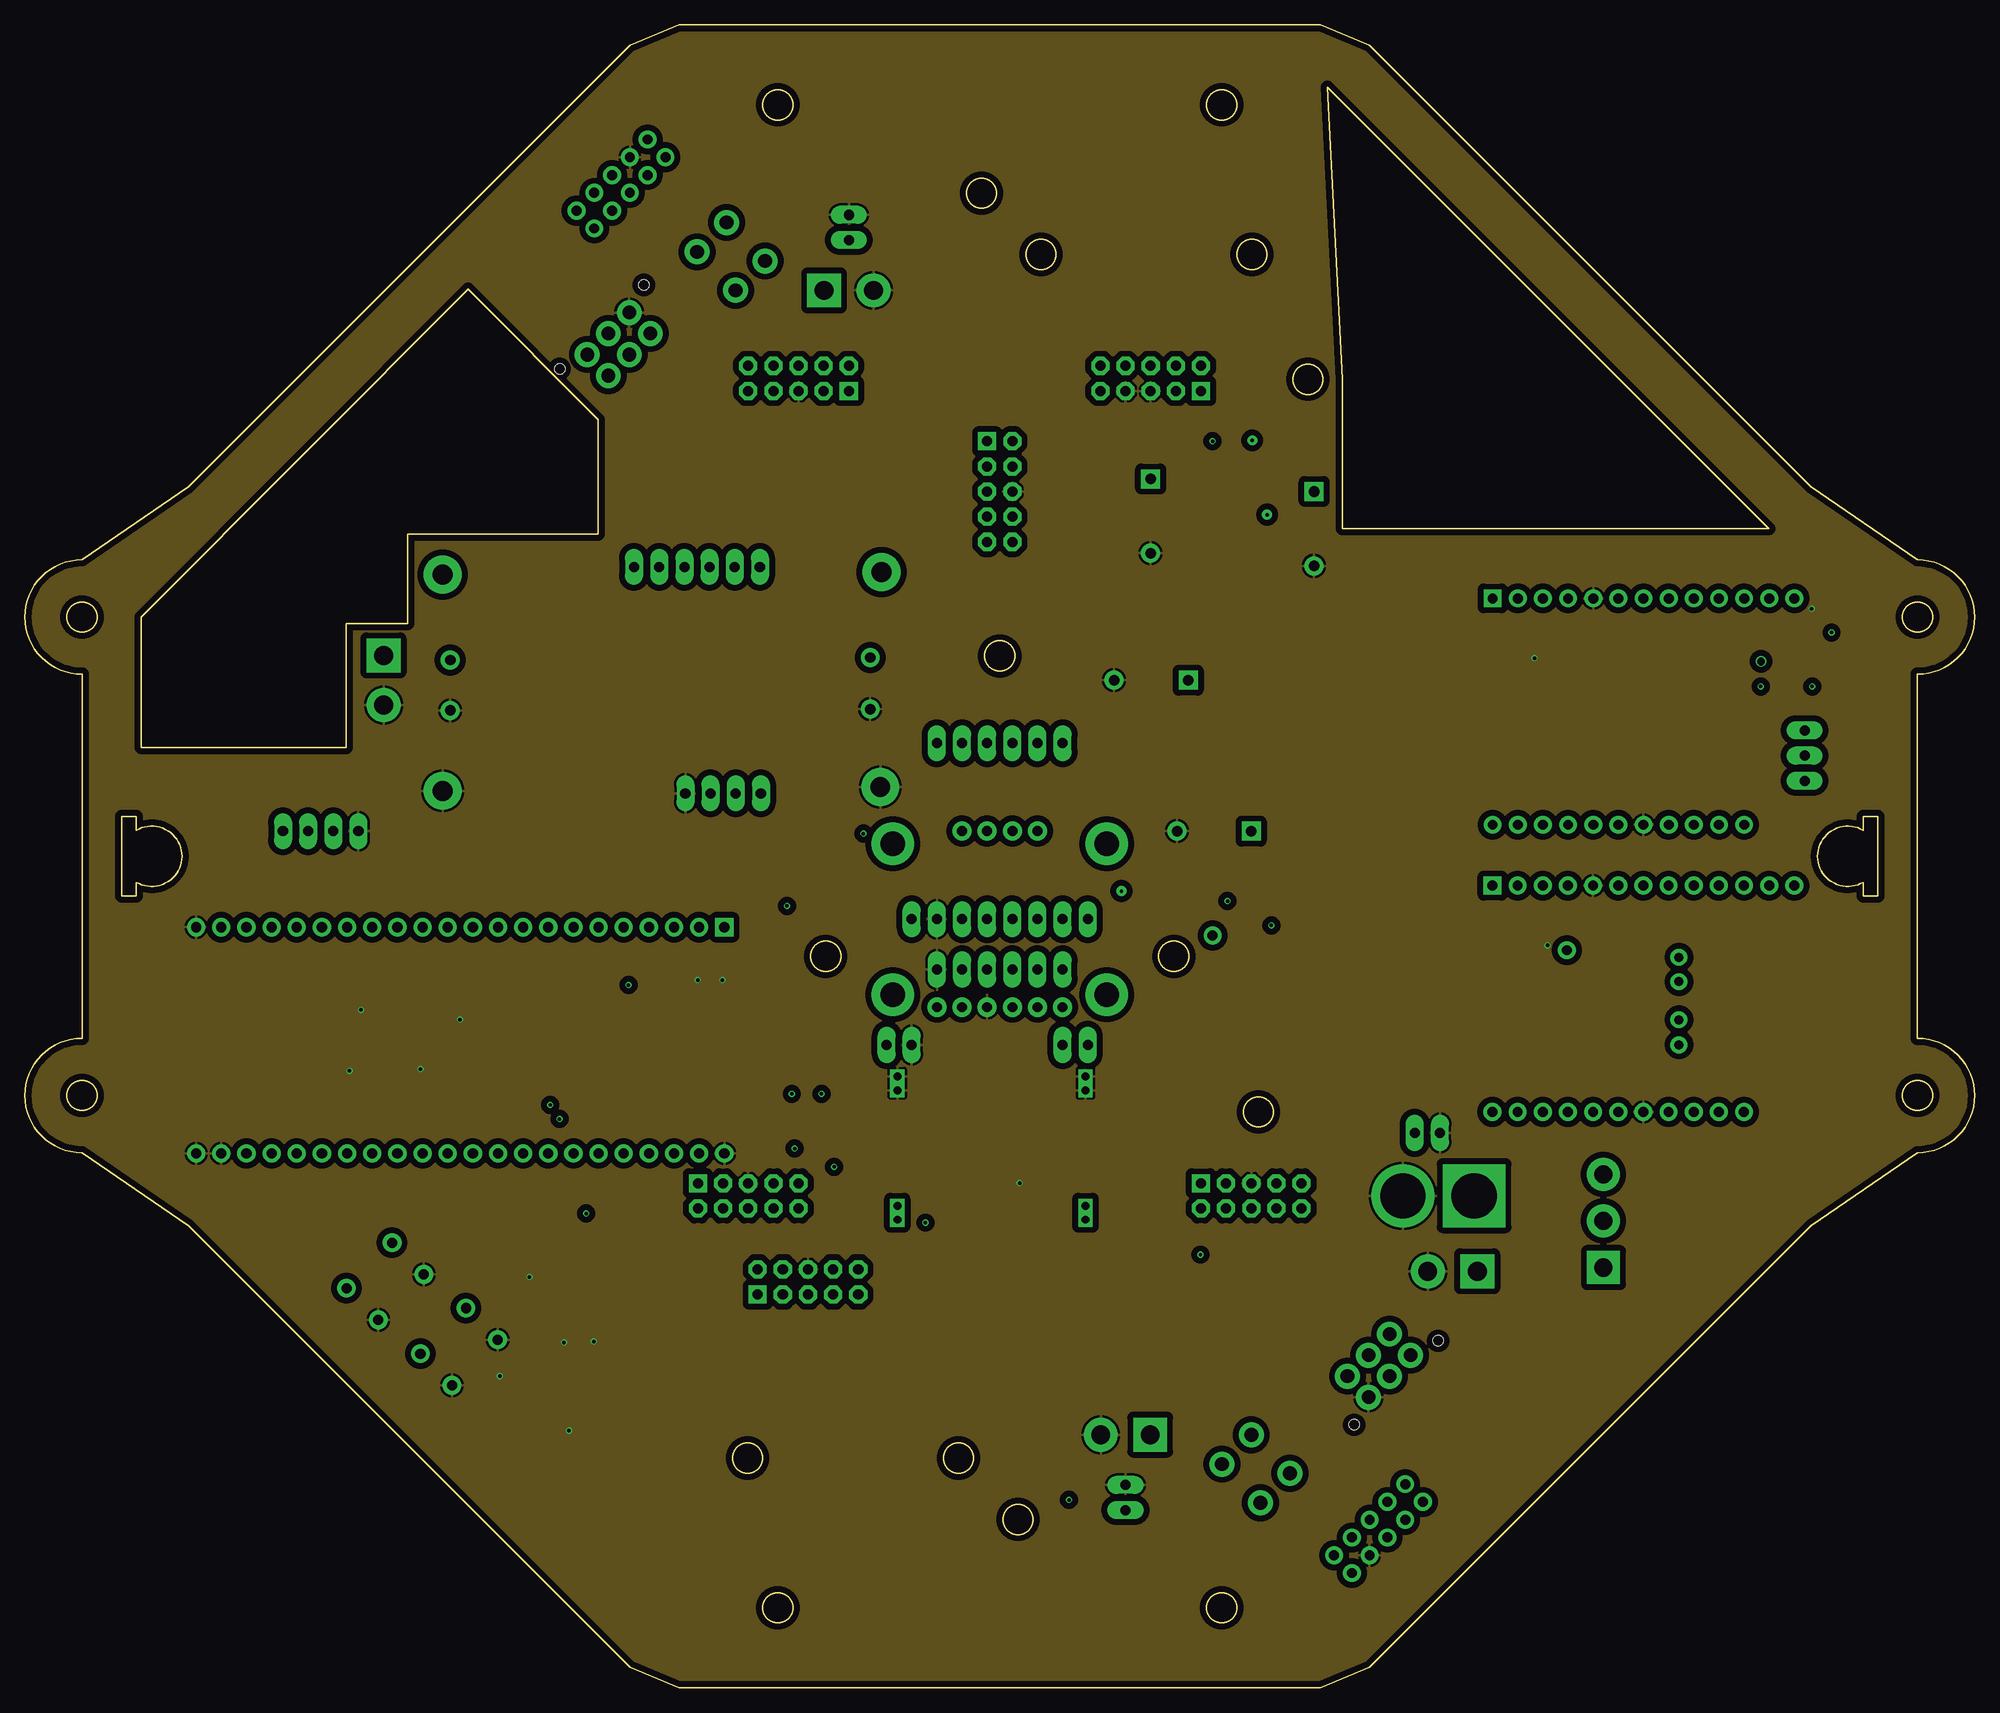
[diagram p3: board, inner layer Route2]
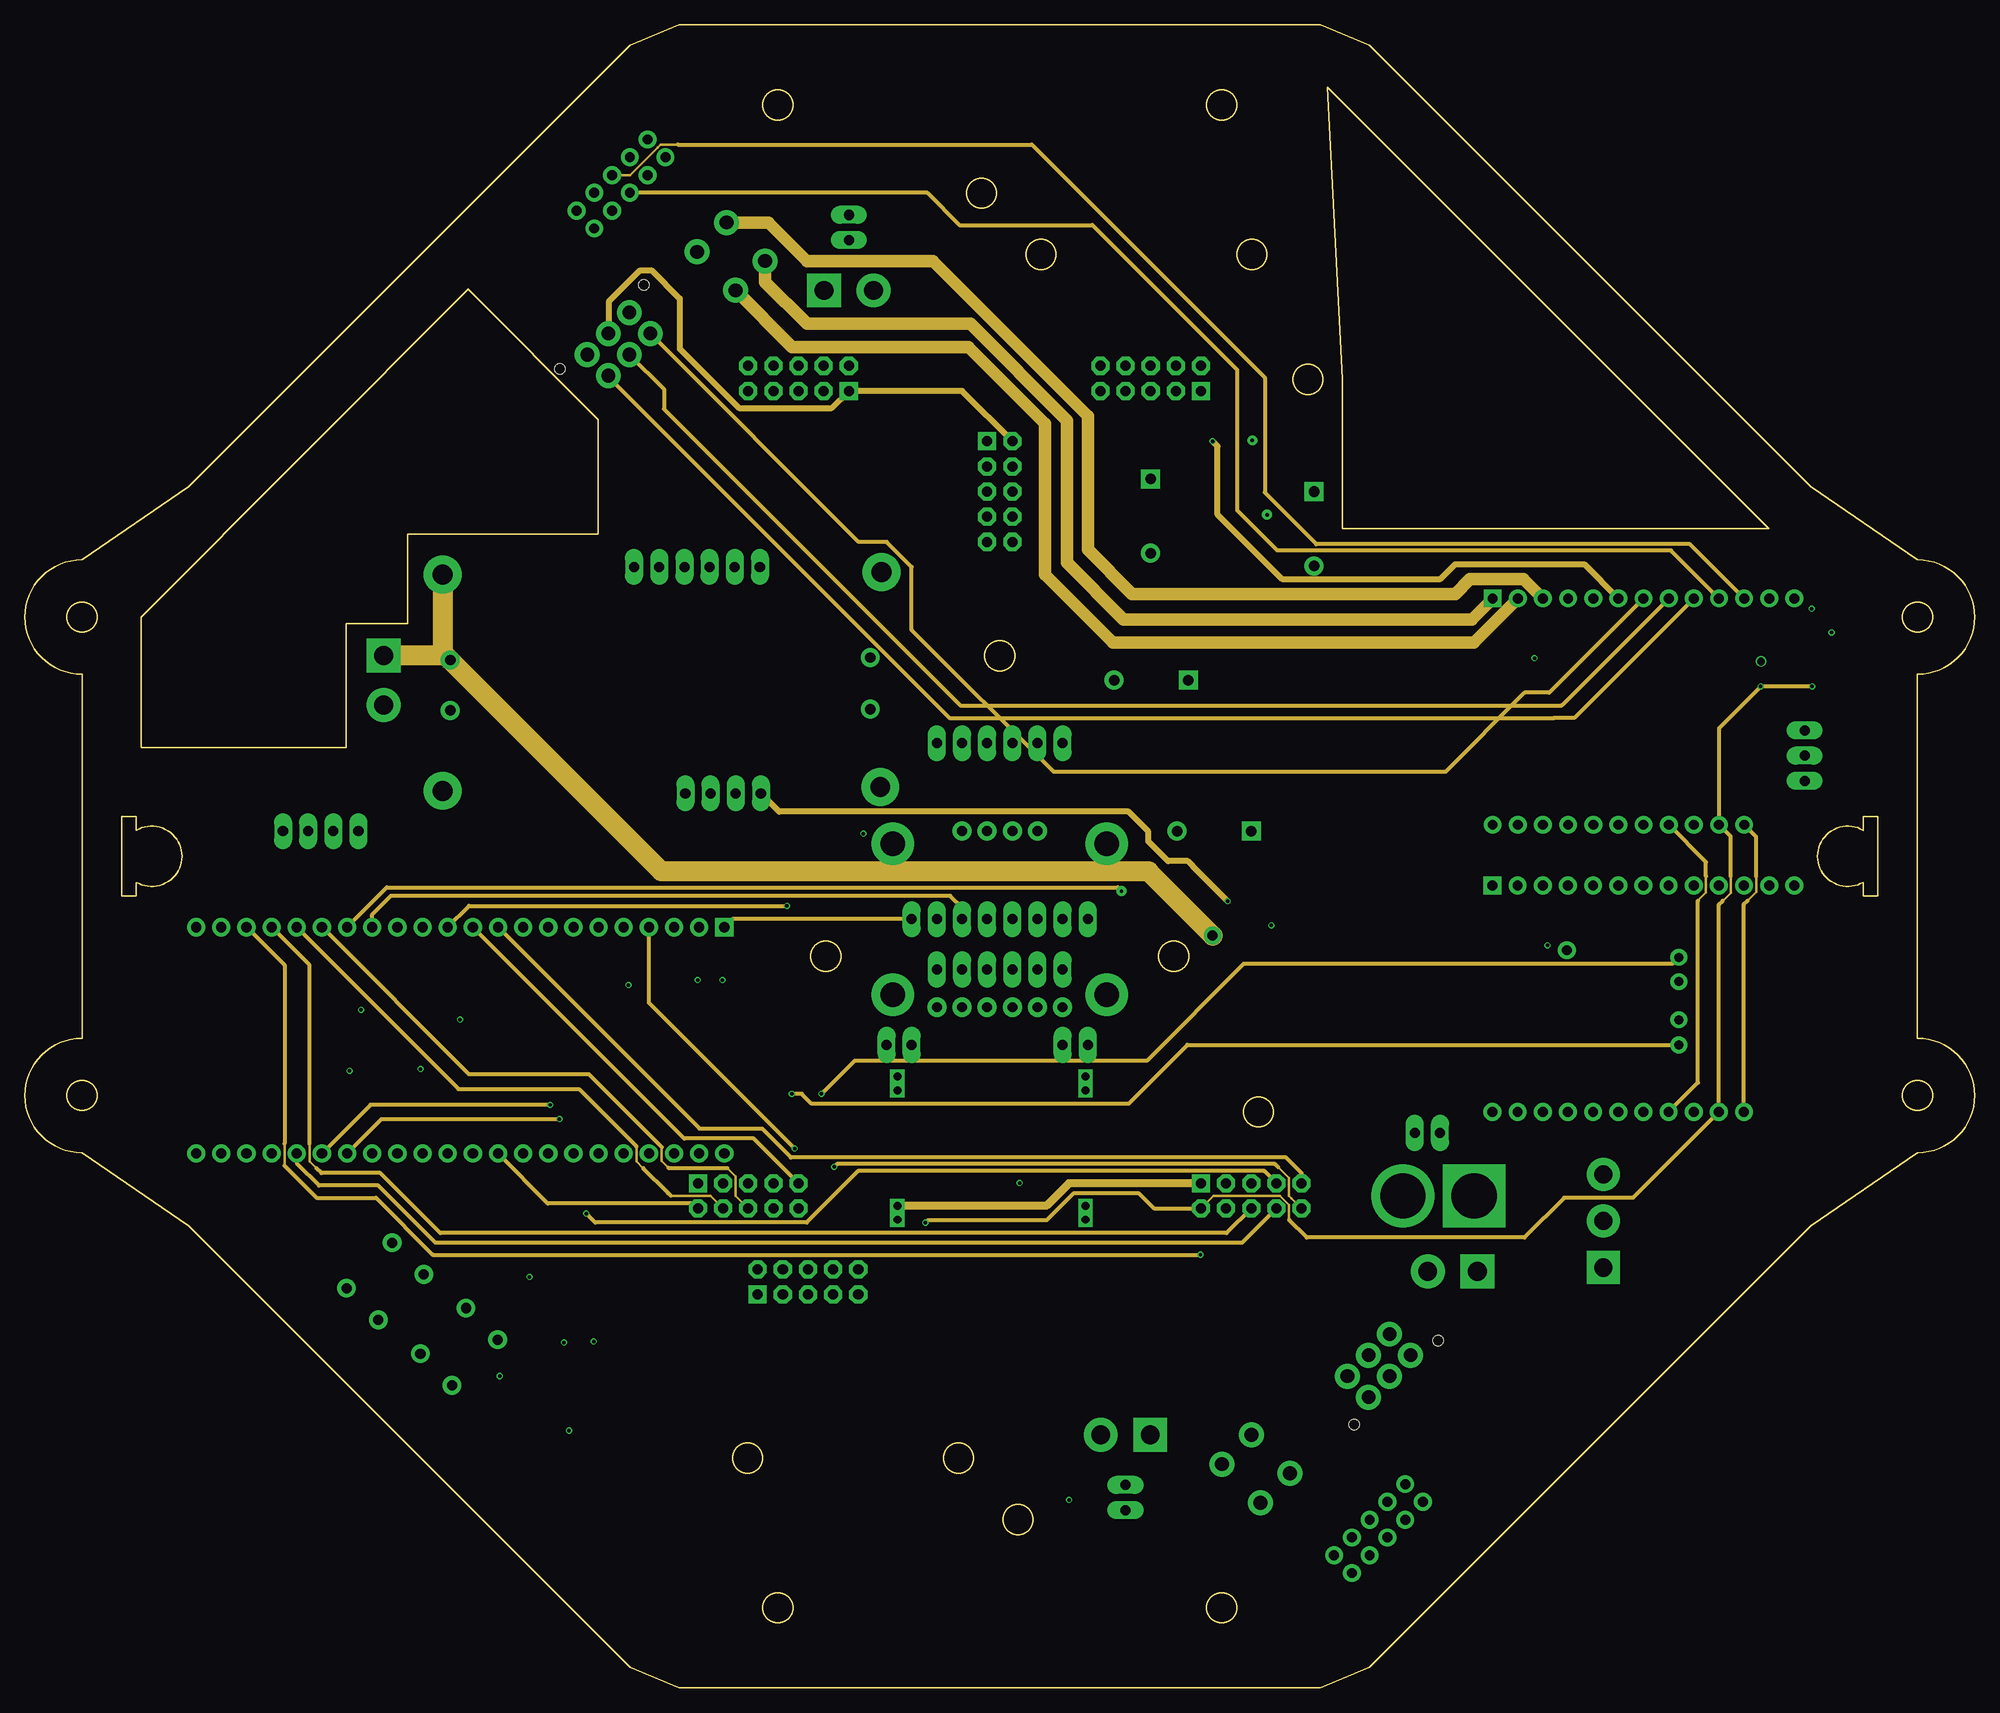
[diagram p4: board, inner layer Route15]
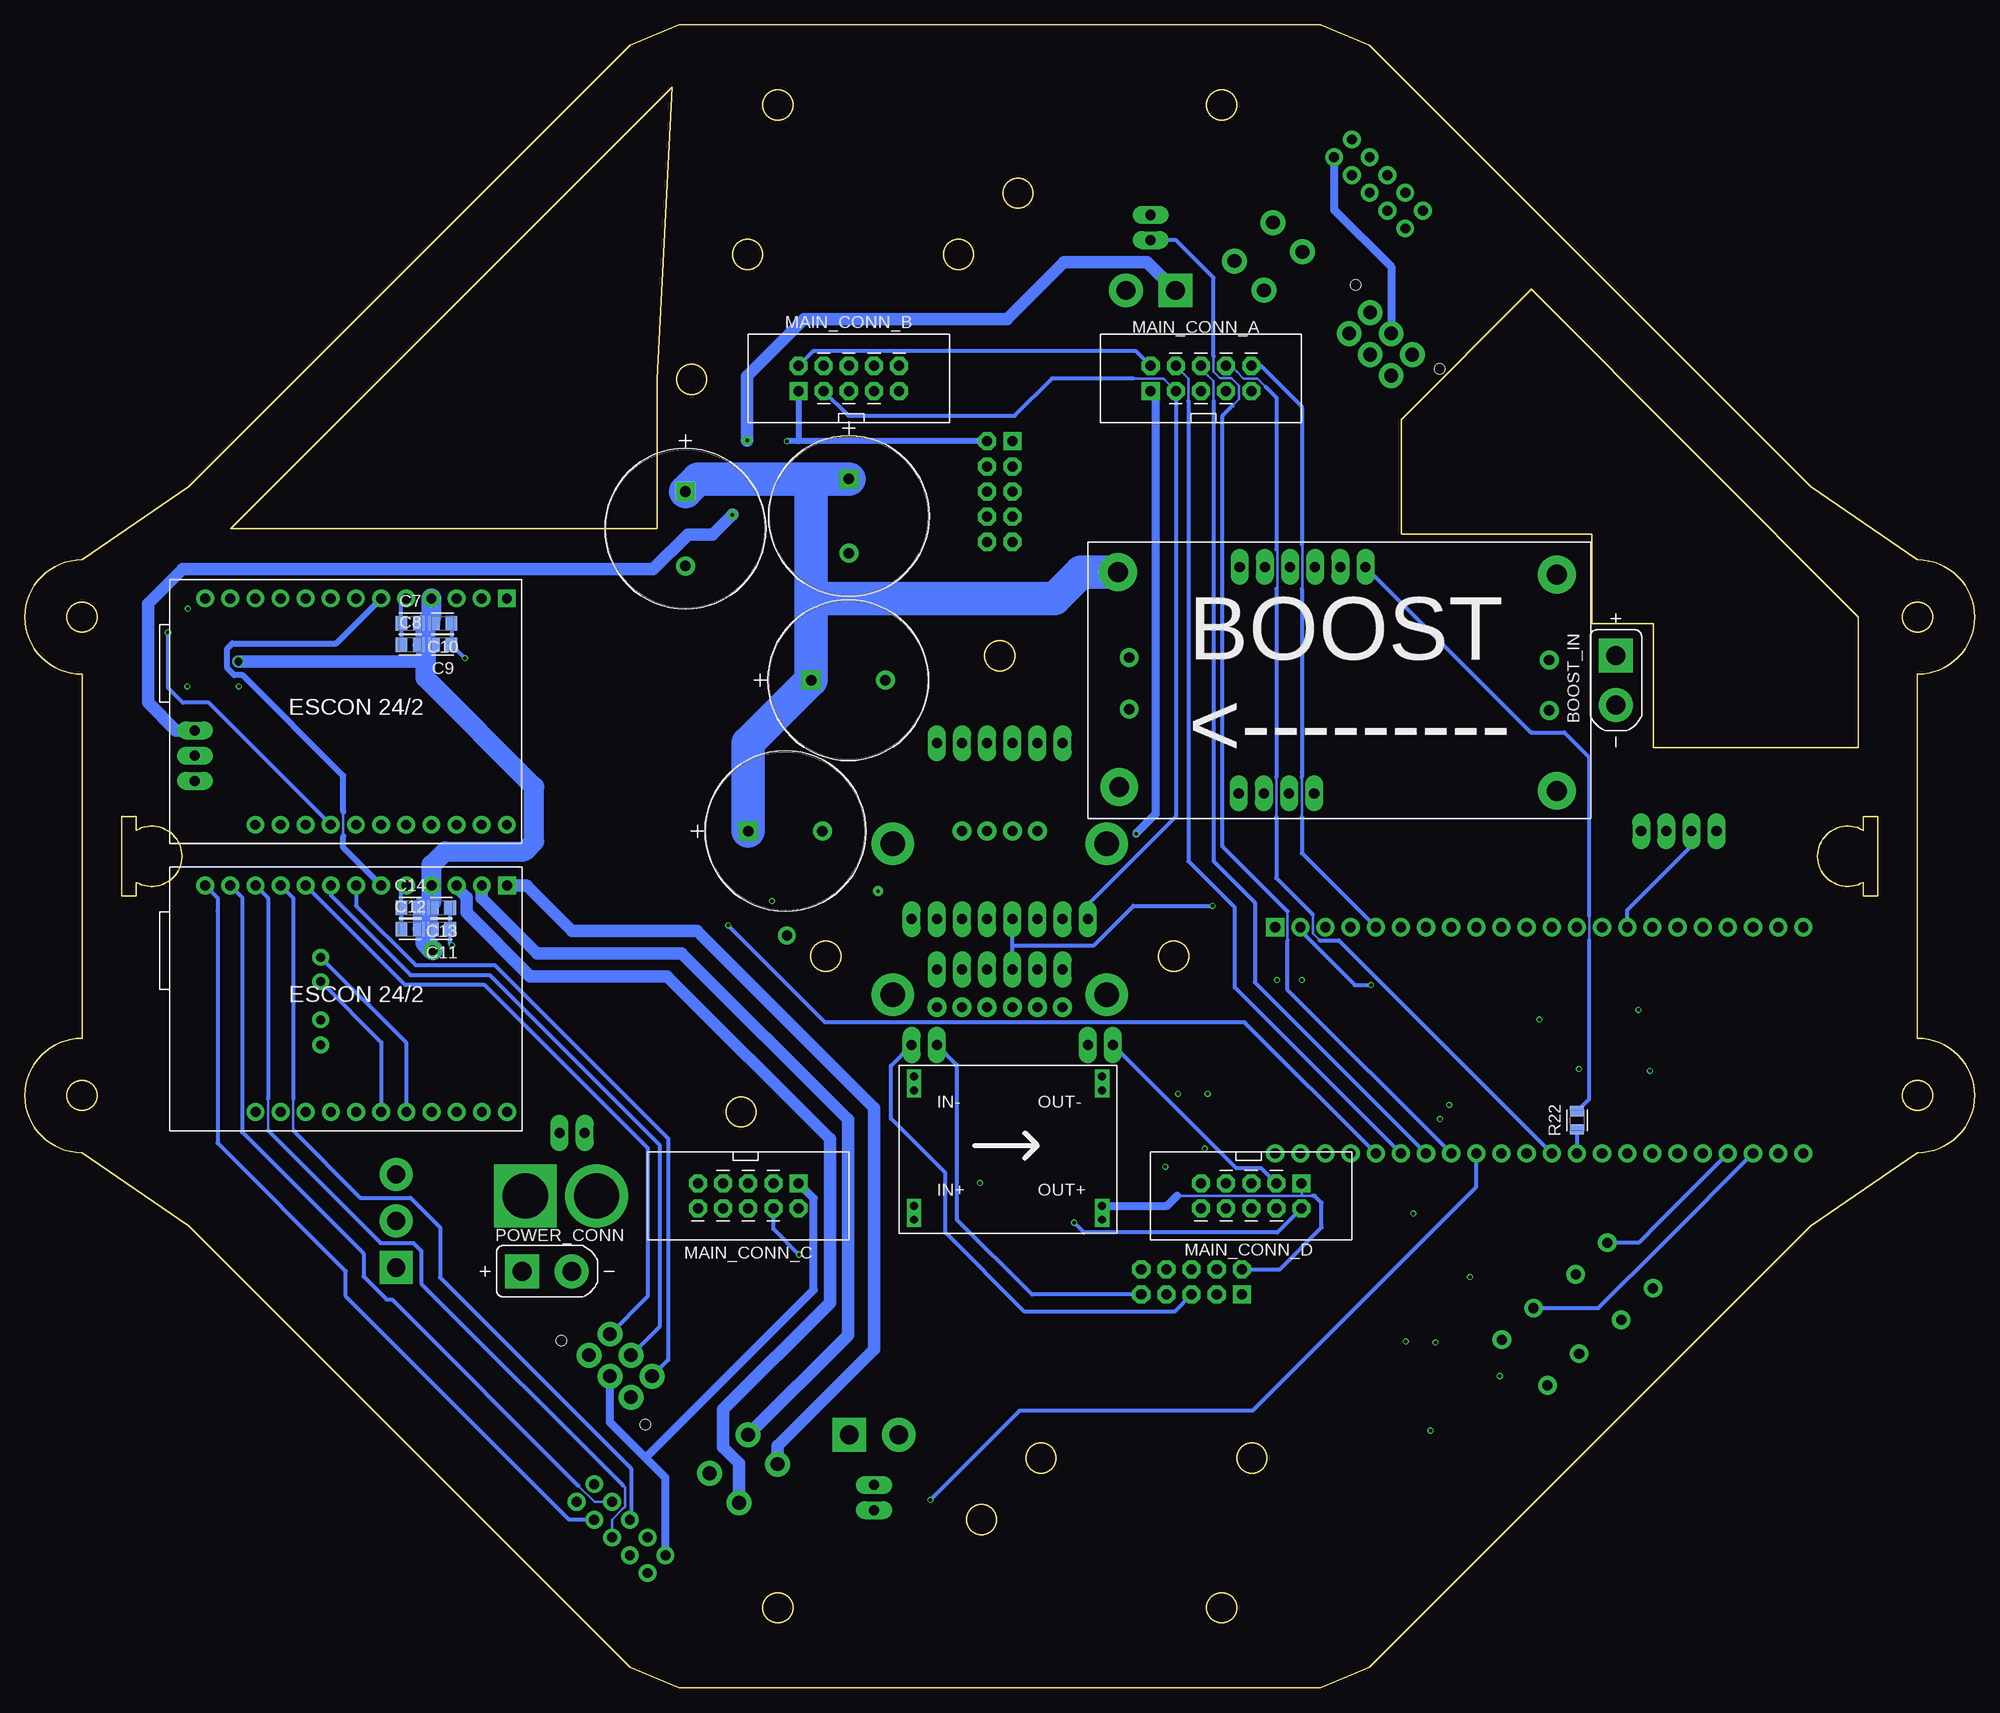
[diagram p5: board, bottom side, seen from below]

Size 196.93 x 167.95 mm. Coordinates in mm from the lower left corner, seen from the top.
Outline: 9.78,79.98 9.78,87.98 11.28,87.98 11.28,86.6 arc-241 11.28,81.35 11.28,79.98 9.78,79.98
Outline: 185.65,79.98 185.65,81.35 arc-241 185.65,86.6 185.65,87.98 187.15,87.98 187.15,79.98 185.65,79.98
Outline: 131.56,161.62 176.11,117.07 133.07,117.07 133.07,132.15 131.56,161.62
Outline: 38.65,107.48 32.46,107.48 32.46,94.98 11.78,94.98 11.78,108.14 44.78,141.24 57.93,128.1 57.93,116.49 38.65,116.49 38.65,107.48
Outline: 5.78,102.36 5.78,65.59 arc180 5.78,54.04 16.57,46.64 61.12,2.09 66.09,0 130.83,0 135.8,2.09 180.35,46.64 191.15,54.04 arc180 191.15,65.59 191.15,102.36 arc180 191.15,113.92 180.35,121.32 135.8,165.87 130.83,167.95 66.09,167.95 61.12,165.87 16.57,121.32 5.78,113.92 arc180 5.78,102.36
Outline: circle at 80.89,73.88 radius 1.5
Outline: circle at 129.57,132.15 radius 1.5
Outline: circle at 73,23.2 radius 1.5
Outline: circle at 191.15,59.81 radius 1.5
Outline: circle at 124.57,58.15 radius 1.5
Outline: circle at 76.05,159.86 radius 1.5
Outline: circle at 191.15,108.14 radius 1.5
Outline: circle at 120.88,159.86 radius 1.5
Outline: circle at 100.3,17 radius 1.5
Outline: circle at 96.63,150.95 radius 1.5
Outline: circle at 120.88,8.09 radius 1.5
Outline: circle at 76.05,8.09 radius 1.5
Outline: circle at 94.3,23.2 radius 1.5
Outline: circle at 5.78,59.81 radius 1.5
Outline: circle at 5.78,108.14 radius 1.5
Outline: circle at 98.46,104.22 radius 1.5
Outline: circle at 116.04,73.88 radius 1.5
Outline: circle at 123.93,144.75 radius 1.5
Outline: circle at 102.63,144.75 radius 1.5
Copper layers (1+2*15+16): Top 0.035mm / dielectric 0.2mm / Route2 0.0175mm / dielectric 1.065mm / Route15 0.0175mm / dielectric 0.2mm / Bottom 0.035mm
Design rules "jlcpcb-4layers.dru *": minimum track width 3.5mil, minimum drill 0.2mm, track to track 5mil, track to pad 0.2mm, pad to pad 5mil, via to via 0.5mm, smd to smd 5mil, copper to edge 0.2mm, drill to drill 6mil, minimum pad ring 10mil, minimum via ring 0.13mm, stop-mask expansion 0.05mm, vias tented up to drill 16mil, thermal gap 10mil

### Footprints (pad centres in the part's own frame; a part is rotated, then mirrored left to right if it is on the bottom)
1X02 = drill 1.016 long: B+ 0,-1.27; B- 0,1.27
AMASS_XT60-M = drill 4.55: N 3.6,0 | drill 4.55 square: P -3.6,0
MODULE_2472 = drill 1 pad 1.93: 1 -6.35,-8.89; 2 -3.81,-8.89; 3 -1.27,-8.89; 4 1.27,-8.89; 5 3.81,-8.89; 6 6.35,-8.89; 7 3.81,8.89; 8 1.27,8.89; 9 -1.27,8.89; 10 -3.81,8.89 | drill 2.5 pad 4: SH1 -10.795,-7.62; SH2 10.795,-7.62; SH3 10.795,7.62; SH4 -10.795,7.62
AMASS_XT30UPB-M = drill 1.9: N 2.5,0 | drill 1.9 square: P -2.5,0
SWITCH-MOMENTARY-PTH-6.5MM = drill 1.016 pad 1.88: 1 -3.251,2.261; 2 3.251,2.261; 3 -3.251,-2.261; 4 3.251,-2.261
CAPC2012X110 = smd 1.165 x 1.465: 1 -0.875,0; 2 0.875,0
CAP_108CKE_ILC = drill 1.067 pad 1.575 square: 1 0,0 | drill 1.067 pad 1.575: 2 7.5,0
LTST-E563CEGBW_LTO-M = smd 1.549 x 0.94: 1 -2.489,1.6; 2 -2.489,-1.6; 3 2.489,1.6; 4 2.489,-1.6
1X04 = drill 1.016 long: 1 -3.81,0; 2 -1.27,0; 3 1.27,0; 4 3.81,0
1X02' = drill 1.016 long: 1 -1.27,0; 2 1.27,0
RESC3216X70 = smd 1.165 x 1.815: 1 -1.475,0; 2 1.475,0
ICM-20948 = drill 1.016 long: ACL 11.43,24.13; AD0 11.43,1.27; ADA 8.89,24.13; CL 8.89,1.27; DA 6.35,1.27; FSNC 6.35,24.13; GND 1.27,1.27; GND2 1.27,24.13; INT 3.81,24.13; NC 13.97,1.27; VIN 3.81,1.27; VIN2 13.97,24.13
2X05 = drill 1.016 square: 1 -5.08,-1.27 | drill 1.016 octagon: 2 -5.08,1.27; 3 -2.54,-1.27; 4 -2.54,1.27; 5 0,-1.27; 6 0,1.27; 7 2.54,-1.27; 8 2.54,1.27; 9 5.08,-1.27; 10 5.08,1.27
TESTPOINT_PAD-036 = drill 0.914 pad 1.676: 1 0,0
1X08 = drill 1.016 long: 1 -8.89,0; 2 -6.35,0; 3 -3.81,0; 4 -1.27,0; 5 1.27,0; 6 3.81,0; 7 6.35,0; 8 8.89,0
TO220BV = drill 1.016 long: D 0,-2.54; G -2.54,-2.54; S 2.54,-2.54
RESC2012X65 = smd 1.031 x 1.42: 1 -0.919,0; 2 0.919,0
SW_100SP1T1B4M2QE = drill 1.85 square: 1 0,4.7 | drill 1.85: 2 0,0; 3 0,-4.7
SO-8_STM = smd 1.46 x 0.533: 1 -2.724,1.905; 2 -2.724,0.635; 3 -2.724,-0.635; 4 -2.724,-1.905; 5 2.724,-1.905; 6 2.724,-0.635; 7 2.724,0.635; 8 2.724,1.905
ESP32-S3-DEVKITC-1-N8R8 = drill 1.02 square: J1_1 -11.43,29.97 | drill 1.02: J1_2 -11.43,27.43; J1_3 -11.43,24.89; J1_4 -11.43,22.35; J1_5 -11.43,19.81; J1_6 -11.43,17.27; J1_7 -11.43,14.73; J1_8 -11.43,12.19; J1_9 -11.43,9.65; J1_10 -11.43,7.11; J1_11 -11.43,4.57; J1_12 -11.43,2.03; J1_13 -11.43,-0.51; J1_14 -11.43,-3.05; J1_15 -11.43,-5.59; J1_16 -11.43,-8.13; J1_17 -11.43,-10.67; J1_18 -11.43,-13.21; J1_19 -11.43,-15.75; J1_20 -11.43,-18.29; J1_21 -11.43,-20.83; J1_22 -11.43,-23.37; J3_1 11.43,29.97; J3_2 11.43,27.43; J3_3 11.43,24.89; J3_4 11.43,22.35; J3_5 11.43,19.81; J3_6 11.43,17.27; J3_7 11.43,14.73; J3_8 11.43,12.19; J3_9 11.43,9.65; J3_10 11.43,7.11; J3_11 11.43,4.57; J3_12 11.43,2.03; J3_13 11.43,-0.51; J3_14 11.43,-3.05; J3_15 11.43,-5.59; J3_16 11.43,-8.13; J3_17 11.43,-10.67; J3_18 11.43,-13.21; J3_19 11.43,-15.75; J3_20 11.43,-18.29; J3_21 11.43,-20.83; J3_22 11.43,-23.37
ROBOCUP_MODULE = drill 1.016 long: 1 -3.81,13.97; 2 -3.81,16.51; 3 -3.81,19.05; 4 -3.81,21.59; 5 19.06,14.07; 6 19.06,16.61; 7 19.06,19.15; 8 19.06,21.69; 9 19.06,24.23; 10 19.06,26.77
DC-BRICK = drill 0.8 square: IN1+ 1.5,1.4; IN1- 1.5,14.47; IN2+ 1.5,2.8; IN2- 1.5,15.87; OUT1+ 20.5,1.4; OUT1- 20.5,14.47; OUT2+ 20.5,2.8; OUT2- 20.5,15.87
BOOST = drill 1.05 pad 1.905: IN2+ 46.609,16.002; IN2- 46.609,10.922; OUT2+ 4.191,16.256; OUT2- 4.191,11.049 | drill 2 pad 3.81: IN+ 47.371,24.638; IN- 47.371,2.794; OUT+ 3.048,24.892; OUT- 3.175,3.175
ESCON24/2 = drill 1 square: 1 34.06,24.765 | drill 1: 2 31.52,24.765; 3 28.98,24.765; 4 26.44,24.765; 5 23.9,24.765; 6 21.36,24.765; 7 18.82,24.765; 8 16.28,24.765; 9 13.74,24.765; 10 11.2,24.765; 11 8.66,24.765; 12 6.12,24.765; 13 3.58,24.765; 14 8.66,1.905; 15 11.2,1.905; 16 13.74,1.905; 17 16.28,1.905; 18 18.82,1.905; 19 21.36,1.905; 20 23.9,1.905; 21 26.44,1.905; 22 28.98,1.905; 23 31.52,1.905; 24 34.06,1.905
PIN2.54-2X5 = drill 1: A1 0,0; A2 0,2.54; A3 2.54,0; A4 2.54,2.54; A5 5.08,0; A6 5.08,2.54; A7 7.62,0; A8 7.62,2.54; A9 10.16,0; A10 10.16,2.54
MX-44914-0601 = drill 1.4: B1 6,0; B2 3,0; B3 0,0; B4 6,3; B5 3,3; B6 0,3 | hole 1.04: -3,3.94; 9,3.94
MX5566 = drill 1.4: C1 4.2,0; C2 0,0; C3 4.2,5.5; C4 0,5.5
VREG_AZ1117CH-3.3TRG1 = smd 2.2 x 1.2: 1 -3.1,2.3; 2 -3.1,0; 3 -3.1,-2.3 | smd 2.2 x 3.5: 4 3.1,0

### Placement (x,y rotation side)
BATT_VOLTAGE  141.64,56.04 270 top
BATTERY_TERMINAL  142.77,49.69 180 top
BNO055  98.46,77.63 0 top
BOOST_IN  36.23,101.76 270 bottom
BTN+  36.4,41.05 45 top
BTN-  43.85,34.45 45 top
C1  70.52,73.82 90 top
C2  94.65,66.2 180 top
C3  32.42,89.56 180 top
C5  42.71,40.04 225 top
C7  158.02,107.48 0 bottom
C8  158.02,105.32 0 bottom
C9  154.72,105.32 180 bottom
C10  154.72,107.48 180 bottom
C11  154.84,76.61 180 bottom
C12  158.02,76.61 0 bottom
C13  154.84,78.77 180 bottom
C14  158.02,78.77 0 bottom
C15  67.98,73.82 90 top
C16  130.21,120.81 270 bottom
C17  113.7,122.08 270 bottom
C18  117.51,101.76 0 bottom
C19  123.86,86.52 0 bottom
C25  54.01,33.18 135 top
C35  179.74,106.84 180 top
DEBUG_A+  51.47,43.34 135 top
DEBUG_A-  57.82,36.99 135 top
DEBUG_B+  50.2,29.37 315 top
DEBUG_B-  56.55,21.75 315 top
DISPLAY  29.88,86.52 180 top
DRB_SW_F  PINHD-1X2  [1X02']  83.22,147.48 90 top
DRB_SW_R  PINHD-1X2  [1X02']  111.16,19.21 90 top
DRIBLER_F_CONN  83.22,141.13 0 top
DRIBLER_R_CONN  111.16,25.56 180 top
F1  153.07,52.23 180 top
ICM-20948  90.84,71.28 0 top
IR_I2C  PINHD-1X2  [1X02']  106.08,64.93 0 top
IR_PWR  PINHD-1X2  [1X02']  88.3,64.93 0 top
MAIN_CONN_A  78.14,132.24 0 bottom
MAIN_CONN_B  113.7,132.24 0 bottom
MAIN_CONN_C  123.86,49.69 180 bottom
MAIN_CONN_D  73.06,49.69 180 bottom
MDRBF_OUT1  167.04,64.93 0 top
MDRBF_OUT2  167.04,67.47 0 top
MDRBR_OUT1  167.04,73.78 0 top
MDRBR_OUT2  167.04,71.32 0 top
MPU-6050  98.46,77.63 0 top
PIXY_FRONT  98.46,120.81 270 top
PIXY_REAR  79.1,40.99 0 top
POWER_CONN  144.18,42.07 0 bottom
Q1  177.2,94.14 90 top
R1  32.42,44.61 225 top
R2  107.77,18.8 270 top
R3  86.93,147.48 270 top
R4  40.3,37.62 225 top
R5  37.5,60.1 270 top
R6  39.79,60.1 90 top
R7  35.09,56.93 270 top
R8  35.09,60.1 270 top
R9  32.8,60.1 90 top
R10  37.63,73.82 90 top
R11  36.11,70.9 0 top
R12  36.11,68.74 180 top
R13  40.17,73.82 90 top
R14  41.69,71.02 180 top
R15  41.69,68.86 0 top
R16  35.09,73.82 90 top
R17  42.71,73.82 90 top
R18  61.76,57.94 270 top
R19  64.05,57.94 270 top
R20  90.84,101.76 270 top
R21  171.67,102.42 0 top
R22  40.16,57.31 90 bottom
R71  37.5,56.93 270 top
R98  184.82,103.03 270 top
S1  159.42,47.15 180 top
U2  179.74,103.03 180 top
U$1  40.68,65.38 270 top
U$2  88.3,94.14 90 top
U$4  108.62,45.88 0 bottom
U$5  89.57,87.79 0 bottom
U$7  182.28,56.25 0 bottom
U$8  134.02,11.59 45 top
U$9  182.3,85.26 0 bottom
U$10  137.83,35.72 225 top
U$11  62.9,156.37 225 top
U$12  58.93,132.53 45 top
U$13  71.79,141.13 45 top
U$14  123.86,25.56 225 top
VR1  97.19,54.77 180 top

### Tracks (layer width: path | path; a pad name or v marks a point on that pad's centre or on a via)
3DOLE,1HORE  (via drill 0.35)
  Top 0.254: 159.68,59.29 159.68,56.75
  Top 0.61: v121.48,79.46 131.7,69.23 134.96,69.23 145.72,69.23 148.46,71.98 152.46,75.98 153.96,75.98 156.96,75.98 157.96,74.98 157.96,70.98 157.96,69.48 159.68,67.76 159.68,59.85 159.68,59.29 | 159.68,56.75 159.68,52.1 S1.3
  Top 1.27: 155.21,52.18 154.6,52.18 F1.1
  Top 3.4: S1.3 159.09,52.18 155.21,52.18
  Route15 0.61: U$2.1 76.18,88.48 111.46,88.48 113.46,86.48 113.46,85.48 115.46,83.48 117.46,83.48 117.96,82.98 117.96,82.97 v121.48,79.46
3V3  (via drill 0.35)
  Top 0.254: 31.3,78.48 31.3,75.65 | 41.46,75.75 41.46,77.48 40.46,78.48 | 82.89,135.05 81.96,134.13 81.96,133.98 81.96,132.25 81.83,132.11 MAIN_CONN_A.3 | 31.31,52.98 31.31,54.98
  Top 0.4: C5.2 R4.1 37.74,41.48 36.85,41.48 R1.1 31.31,47.03 31.31,52.98 | C3.2 31.55,86.91 DISPLAY.2 31.15,78.48 31.25,78.48 31.3,78.48 40.46,78.48 | R14.1 42.61,72.8 R17.1 | R5.1 R8.1 35.09,62.35 33.96,63.48 31.31,63.48 | U$1.J1_1 70.52,76.69 C1.2 C15.2 67.98,76.69 U$1.J1_2 | 82.89,135.05 88.46,140.63 88.46,147.7 87.76,148.4 86.94,148.4 R3.1 | 31.31,54.98 31.31,63.48 | 31.31,63.48 31.31,67.02 R11.1 35.19,72.8 R16.1 34.04,72.9 31.3,75.65 | R17.1 41.46,74.15 41.46,75.75 | R17.1 42.79,72.98 58.96,72.98 v60.96,70.98
  Top 0.61: MAIN_CONN_C.3 121.32,52.46 119.01,54.77 105.06,54.77 | 105.06,54.77 99.86,54.77 | R2.1 107.77,21.49 105.06,24.19 105.06,54.77 | BNO055.1 92.11,66.93 92.84,66.2 C2.2 93.78,64.06 97.86,59.98 102.46,59.98 105.06,57.38 105.06,54.77 | IR_PWR.1 87.03,65.42 90.35,68.74 BNO055.1 | BNO055.1 94.65,71.28 ICM-20948.VIN 94.65,73.79 93.46,74.98 90.96,74.98 89.57,76.37 MPU-6050.1
  Top 0.813: VR1.4 99.86,54.77 VR1.2
  Route15 0.4: MPU-6050.1 71.46,77.63 U$1.J1_1
  Bottom 0.254: MAIN_CONN_A.3 81.83,132.11 81.95,132.24 84.96,132.24
  Bottom 0.4: MAIN_CONN_B.3 113.75,128.48 96.96,128.48 93.2,132.24 84.96,132.24 | MAIN_CONN_A.3 80.68,88.02 89.57,79.13 MPU-6050.1 | MAIN_CONN_D.3 72.04,52.48 74.58,52.48 IR_PWR.1 | U$1.J1_2 68.11,76.48 62.6,70.98 v60.96,70.98
+5V  (via drill 0.35)
  Top 0.61: DEBUG_A+.4 50.84,44.6 55.56,39.88 DEBUG_A-.4 57.19,39.75 58.46,38.48 60.96,38.48 62.46,36.98 62.46,34.98 59.54,32.06 55.13,32.06 C25.1 50.83,28.76 DEBUG_B+.4 50.83,22.61 54.58,18.86 DEBUG_B-.4 62.65,13.38 U$8.A2
  Top 0.813: U$4.OUT2+ 88.12,57.58 | VR1.3 96.57,57.07 96.06,57.58 88.12,57.58 | v84.7,86.26 84.7,61 88.12,57.58
  Route15 0.61: PIXY_FRONT.2 94.65,130.97 MAIN_CONN_A.1 81.5,129.24 72.13,129.24 66.14,135.23 66.14,140.3 63.28,143.16 62.15,143.16 58.96,139.98 58.96,136.81 U$12.B5 | v119.96,125.89 120.46,125.39 120.46,118.48 126.96,111.98 142.96,111.98 144.46,113.48 157.48,113.48 U$9.6
  Route15 0.813: MAIN_CONN_C.1 105.44,50.96 103.16,48.68 U$4.OUT2+
  Bottom 0.254: 80.56,49.69 67.96,49.69 | 164.76,85.98 164.76,88.48 | 67.96,49.69 67.96,50.94 MAIN_CONN_D.1 | 67.96,49.69 66.87,49.69
  Bottom 0.406: PIXY_REAR.2 70.18,42.26 65.96,46.48 65.96,48.98 66.67,49.69 66.87,49.69
  Bottom 0.61: MAIN_CONN_B.1 118.78,125.89 | PIXY_FRONT.2 118.78,125.89 | 118.78,125.89 v119.96,125.89 | U$7.6 164.76,84.85 164.76,85.98 | 164.76,88.48 164.76,92.11 174.92,102.27 175.75,102.27 176.46,102.98 176.46,104.98 175.96,105.48 165.46,105.48 160.94,110 U$9.6
  Bottom 0.813: U$11.A2 64.7,149.27 58.93,143.51 U$12.B5 | U$8.A2 132.23,21.22 134.22,23.22 | 134.22,23.22 137.83,26.83 U$10.B5 | 134.22,23.22 117.26,40.18 117.26,49.43 MAIN_CONN_C.1 | 80.56,49.69 81.57,48.68 U$4.OUT2+ U$4.OUT1+ | v84.7,86.26 82.72,88.24 82.72,130.47 MAIN_CONN_A.1
+V  (via drill 0.8, 1 pad 1.8)
  Top 1.27: v175.35,103.66 U2.6 178.85,103.66 | 178.85,103.66 178.85,101.12 178.83,101.1 178.83,100.28 176.6,98.06 176.6,95.54 178.01,94.14 Q1.D | 132.96,44.96 109.44,44.96 U$4.IN1+ U$4.IN2+ | C35.2 178.87,103.68 178.85,103.66
  Top 2.032: 155.73,73.41 v155.73,74.49 | v119.96,75.98 137.46,58.48 139.9,56.04 BATT_VOLTAGE.B+
  Top 2.54: 155.73,73.41 155.73,71.39 145.31,60.98 139.96,60.98 137.46,58.48 132.96,53.98 132.96,44.96 139.66,38.26 144.39,38.26 146.68,40.55 POWER_CONN.P
  Top 3.4: S1.2 154.34,42.07 POWER_CONN.P
  Route15 2.032: v119.96,75.98 113.49,82.45 64.31,82.45 U$5.IN2+ 42.5,104.26 42.2,104.26 | U$5.IN+ 42.2,104.26 | 42.2,104.26 BOOST_IN.P
  Bottom 0.813: 156.65,103.66 156.46,103.48
  Bottom 1.27: C8.2 156.46,105.32 C9.2 | C7.2 156.46,107.48 C10.2 | C11.2 156.46,76.61 C12.2 | C14.2 156.46,78.77 C13.2 | v175.35,103.66 156.65,103.66
  Bottom 2.032: v155.73,74.49 156.46,75.22 156.46,76.61 | 156.46,78.77 155.84,79.39 U$7.4 155.84,83.1 154.46,84.48 146.46,84.48 145.46,85.48 145.46,90.98 156.46,101.98 156.46,103.48 156.46,105.32 156.46,107.48 155.86,108.09 U$9.4
  Bottom 2.54: 156.46,76.61 156.46,78.77
BTN+
  Bottom 0.4: U$1.J3_19 31.91,46.98 33.94,44.95 BTN+.2
BTN-
  Bottom 0.4: U$1.J3_20 31.4,44.95 38,38.34 BTN-.2
BUKAJ_MODUL
  Bottom 0.254: 38.93,75.48 38.93,77.98
  Bottom 0.4: 38.93,77.98 38.93,93.94 41.46,96.48 44.81,96.48 U$2.10
  Bottom 0.406: R22.2 38.93,59.46 38.93,75.48
DRB_SW_F
  Top 0.4: R3.2 86.85,146.48 83.49,146.48 DRB_SW_F.1
  Bottom 0.254: 69.39,75.48 69.39,78.41 | 76.87,134.48 76.87,132.91 76.21,132.24 75.05,132.24 74.31,131.5 74.31,130.13 74.96,129.48
  Bottom 0.4: U$1.J3_8 69.39,70.48 69.39,75.48 | 69.39,78.41 75.96,84.98 75.96,128.48 74.96,129.48 | 76.87,134.48 76.87,142.39 80.69,146.21 DRB_SW_F.1
DRB_SW_R  (via drill 0.35)
  Top 0.4: DRB_SW_R.1 111.11,17.88 R2.2 106.56,17.88 v105.46,18.98
  Bottom 0.4: v105.46,18.98 96.46,27.98 72.96,27.98 50.33,50.61 U$1.J3_9
GND  (via drill 0.35)
  Top 0.4: BTN-.4 47.75,34.08 DEBUG_B+.1 48.79,31.48 v47.96,31.48 | C3.1 33.3,86.91 DISPLAY.1 | C5.1 42.23,41.75 BTN+.4 | R20.2 86.11,100.84 85.38,100.11 U$5.OUT2- | U2.3 184.54,103.66 R98.1 184.82,106.12 181.96,108.98 v180.46,108.98 180.46,106.99 C35.1 | DEBUG_B-.1 54.96,25.6 v54.96,25.98 | DEBUG_A-.1 58.35,34.1 v57.46,34.98 | DEBUG_A+.1 52,40.45 v50.96,41.48 | C25.2 v54.46,34.87 | R9.2 v32.8,62.32 | R6.2 39.79,62.3 v39.96,62.48 | R12.2 34.22,68.74 v33.96,68.48 | R15.2 43.96,67.52 v43.96,67.48 | VR1.1 100.29,51.15 v100.46,50.98 | C1.1 70.52,71.54 v70.46,71.48 | C15.1 67.98,71.5 v67.96,71.48
  Top 0.61: C2.1 97.19,67.86 BNO055.3
  Bottom 0.4: C10.1 C9.1 152.5,103.98 v152.46,103.98 | C12.1 C14.1 158.89,80.5 U$7.5 | C8.1 C7.1 158.89,109.53 U$9.5 | v153.78,74.98 153.97,75.17 C11.1 C13.1
  pour Route2 (isolate 0.6): 57.49,-11.55 154.23,-11.55 215.79,50.01 215.79,119.95 137.23,198.5 66.69,198.5 -11.46,120.35 -11.46,57.41
KICKER_F
  Top 0.254: 67.96,115.48 67.88,115.4 67.88,111.06 67.96,110.98
  Top 0.4: MAIN_CONN_A.7 67.96,123.33 67.96,115.48 | U$1.J1_7 55.41,92.98 67.96,105.53 67.96,110.98
KICKER_R
  Route15 0.4: MAIN_CONN_C.8 122.96,44.98 41.46,44.98 35.71,50.73 29.71,50.73 27.47,52.97 U$1.J3_18
LED_SET_DEBUG1
  Top 0.4: DEBUG_A-.3 51.66,34.35 51.66,31.78 49.88,30 DEBUG_B+.2
LED_SET_O
  Bottom 0.254: 66.85,78.09 66.85,76.19 66.14,75.48 | MAIN_CONN_A.8 75.1,133.51 74.52,132.92 73.83,132.24 72.96,132.24 72.46,132.24 71.58,131.36 | 70.52,91.98 70.52,87.98 | 70.52,114.98 70.43,114.89 70.43,111.07 70.52,110.98
  Bottom 0.4: 66.85,78.09 70.52,81.77 70.52,87.98 | U$1.J3_12 64.23,75.48 66.14,75.48 | 70.52,114.98 70.52,130.3 71.58,131.36 | 70.52,110.98 70.52,91.98
LED_SET_X
  Top 0.254: 94.6,124.62 100.96,124.62 | 116.65,134.98 117.51,134.12 117.51,130.03 116.96,129.48
  Top 0.4: 83.78,50.52 83.78,86.16 81.46,88.48 81.46,111.48 94.6,124.62 | 116.96,129.48 112.1,124.62 100.96,124.62 | 116.65,134.98 112.63,134.98 MAIN_CONN_B.8
  Top 0.406: DEBUG_B-.3 65.46,27.14 65.46,40.98 68.96,44.48 77.74,44.48 83.78,50.52
LED_SET_XDEBUG
  Top 0.4: DEBUG_A+.2 54.37,44.08 45.25,53.19 U$1.J3_11
LINE_AREAD  (via drill 0.35)
  Top 0.4: v81.75,52.61 79.53,52.61 77.74,54.4 v77.74,54.47
  Route15 0.254: MAIN_CONN_C.10 127.92,49.44 127.67,49.69 127.67,50.98 127.67,51.48 126.57,52.58
  Route15 0.4: v81.75,52.61 82.04,52.91 126.24,52.91 126.57,52.58 | v77.74,54.47 63.03,69.18 U$1.J1_4
LINE_BREAD
  Bottom 0.254: 67.96,115.48 67.88,115.4 67.88,111.06 67.96,110.98 | 67.96,91.98 67.96,87.98
  Bottom 0.4: MAIN_CONN_A.10 72.06,133.51 67.96,129.41 67.96,115.48 | U$1.J1_5 67.96,84.29 67.96,87.98 | 67.96,110.98 67.96,92.48 67.96,91.98
LINE_SET0
  Top 0.254: 49.09,54.86 49.09,53.24
  Top 0.4: R71.1 R5.2 R6.1 44.76,59.18 49.09,54.86 | 49.09,53.24 55.35,46.98 74.16,46.98 MAIN_CONN_D.8
LINE_SET1
  Top 0.254: 46.53,54.91 46.53,53.32
  Top 0.4: R9.1 R8.2 R7.1 36.01,56.93 44.51,56.93 46.53,54.91 | 46.53,53.32 53.87,45.98 75.7,45.98 MAIN_CONN_D.10
LINE_SET2  (via drill 0.35)
  Top 0.254: 51.59,54.86 51.59,53.01
  Top 0.4: R10.1 37.63,71.5 R11.2 R12.1 37.7,68.74 51.59,54.86 | 51.59,53.01 v56.7,47.89
  Route15 0.4: MAIN_CONN_C.7 125.17,52.19 84.17,52.19 78.96,46.98 57.62,46.98 v56.7,47.89
LINE_SET3
  Top 0.254: 54.17,55.47 54.17,53.26 | 57.73,49.7 74.35,49.7 MAIN_CONN_D.7
  Top 0.4: R13.1 40.17,71.63 R14.2 R15.1 54.17,55.47 | 54.17,53.26 57.73,49.7
LINE_XREAD
  Top 0.4: U$1.J1_6 57.95,93.96 97.49,133.51 MAIN_CONN_B.10
M_EN  (via drill 0.35)
  Top 0.4: U2.1 v180.52,101.12 | v175.32,101.12 U2.8 | MAIN_CONN_B.2 121.46,130.83 121.46,117.48 148.96,89.98 168.28,89.98 U$9.15
  Route15 0.254: 172.28,81.98 172.28,80.29 171.46,79.48 | MAIN_CONN_C.2 120.05,49.69 126.75,49.69 127.67,48.77 127.67,47.27
  Route15 0.4: v180.52,101.12 v175.32,101.12 171.08,96.89 171.08,87.18 U$9.15 172.28,85.98 172.28,81.98 | v90.96,46.98 91.23,47.24 103.23,47.24 105.96,49.98 112.46,49.98 114.02,48.42 MAIN_CONN_C.2 | 127.67,47.27 129.46,45.48 151.46,45.48 155.46,49.48 162.41,49.48 U$7.15 171.08,79.1 171.46,79.48 | U$1.J3_10 52.83,48.92 67.48,48.92 MAIN_CONN_D.2
  Bottom 0.4: MAIN_CONN_A.2 84.69,134.98 117.31,134.98 MAIN_CONN_B.2 | MAIN_CONN_D.2 70.42,45.98 89.96,45.98 v90.96,46.98
MA_DIR
  Bottom 0.254: MAIN_CONN_A.4 79.81,132.63 79.41,132.24 79.41,129.98
  Bottom 0.4: 79.41,129.98 79.41,83.48 74.72,78.78 74.72,70.72 U$1.J3_6
MA_OSPD
  Top 0.254: 65.34,110.98 65.34,115.32
  Top 0.4: MAIN_CONN_A.9 65.34,123.25 65.34,115.32 | U$1.J1_8 52.87,91.98 65.34,104.45 65.34,110.98
MA_PWM
  Bottom 0.254: MAIN_CONN_A.6 78.14,133.25 77.42,132.52 76.87,131.98 76.87,129.98
  Bottom 0.4: 76.87,129.98 76.87,83.48 72.7,79.3 72.7,71.24 U$1.J3_7
MB_DIR  (via drill 0.35)
  Top 0.254: MAIN_CONN_B.4 114.96,132.23 114.96,129.98 | 64.28,77.98 64.29,77.96 64.29,75.51 64.28,75.49
  Top 0.4: 114.96,129.98 113.46,128.48 96.96,128.48 64.28,95.79 64.28,77.98 | 64.28,75.49 64.28,67.69 v54.01,57.43
  Route15 0.4: U$1.J3_16 36.03,57.43 v54.01,57.43
MB_OSPD
  Top 0.254: 57.96,74.98 59.23,76.25 59.23,76.98 59.23,77.88
  Top 0.4: MAIN_CONN_B.9 96.45,130.97 59.46,93.98 59.23,93.75 59.23,77.88 | 57.96,74.98 52.17,74.98 U$1.J1_9
MB_PWM  (via drill 0.35)
  Top 0.254: MAIN_CONN_B.6 112.43,132.24 112.43,130.45 111.46,129.48 | 61.79,75.48 61.79,77.98
  Top 0.4: 111.46,129.48 96.46,129.48 61.79,94.8 61.79,77.98 | 61.79,75.48 61.79,67.58 v53.08,58.87
  Route15 0.4: v53.08,58.87 34.92,58.87 U$1.J3_17
MC_DIR  (via drill 0.35)
  Route15 0.254: 26.23,54.98 26.23,52.72
  Route15 0.4: U$1.J1_20 26.23,72.98 26.23,54.98 | 26.23,52.72 29.46,49.48 35.46,49.48 41.2,43.74 v118.73,43.74
  Bottom 0.4: v118.73,43.74 121.32,46.33 MAIN_CONN_C.4
MC_OSPD
  Route15 0.4: U$1.J1_10 68.13,56.48 74.46,56.48 77.38,53.56 127.38,53.56 128.94,52 MAIN_CONN_C.9
MC_PWM
  Route15 0.254: 28.77,54.98 28.77,53.48 28.77,53.18 29.46,52.48
  Route15 0.4: 29.46,52.48 29.96,51.98 35.9,51.98 41.96,45.92 121.36,45.92 MAIN_CONN_C.6 | 28.77,54.98 28.77,72.98 U$1.J1_19
MD_DIR
  Route15 0.254: MAIN_CONN_D.4 69.25,49.69 65.25,49.69 | 61.79,54.66 61.79,53.48 61.79,53.16 62.46,52.48
  Route15 0.4: U$1.J1_18 43.81,60.48 55.96,60.48 61.79,54.66 | 65.25,49.69 64.96,49.98 62.46,52.48
MD_OSPD
  Route15 0.4: MAIN_CONN_D.9 73.62,55.48 66.59,55.48 U$1.J1_11
MD_PWM
  Route15 0.254: 70.96,52.48 71.79,51.65 71.79,49.98 71.79,49.69 MAIN_CONN_D.6 | 64.33,54.62 64.33,53.19 65,52.52
  Route15 0.4: 70.96,52.48 65.04,52.48 65,52.52 | U$1.J1_17 44.85,61.98 56.96,61.98 64.33,54.62
MDF_CHA
  Route15 0.4: U$11.A6 91.15,150.98 94.4,147.73 107.81,147.73 122.47,133.08 122.47,118.9 126.5,114.86 166.26,114.86 U$9.10
MDF_CHA\\
  Route15 0.254: U$11.A5 61.14,152.78 63.9,155.54 64.22,155.86 65.96,155.86
  Route15 0.4: 65.96,155.86 101.72,155.86 125.24,132.34 125.24,120.71 130.44,115.5 168.16,115.5 U$9.11
MDF_CHB
  Top 0.4: U$11.A8 67.91,149.18 69.71,150.98 91.15,150.98 94.4,147.73 109.84,147.73 125.24,132.34 125.24,120.71 131.96,113.98 172.22,113.98 U$9.12
MDF_CHB\\
  Top 0.254: U$11.A7 59.34,150.98 63.9,155.54 64.22,155.86 65.96,155.86
  Top 0.4: 65.96,155.86 103.78,155.86 126.26,133.38 126.26,120.9 132.25,114.92 149.46,114.92 150.22,114.92 173.82,114.92 U$9.13
MDF_HS1
  Route15 0.4: U$12.B1 84.23,115.73 87.03,115.73 89.57,113.19 89.57,106.84 103.92,92.49 143.46,92.49 151.46,100.49 153.94,100.49 U$9.7
MDF_HS2
  Route15 0.4: U$12.B2 64.56,131.16 64.56,129.16 94.49,99.22 155.21,99.22 U$9.8
MDF_HS3
  Route15 0.4: U$12.B3 58.93,132.4 93.38,97.95 154.46,97.95 156.48,97.95 U$9.9
MDF_MW1
  Route15 1.27: U$13.C1 74.76,141.97 78.98,137.75 95.49,137.75 105.24,128 105.24,113.62 110.96,107.9 146.12,107.9 U$9.1
MDF_MW2
  Route15 1.27: U$13.C2 77.51,135.41 95.29,135.41 103.04,127.67 103.04,112.43 109.89,105.57 146.32,105.57 U$9.2
MDF_MW3
  Route15 1.27: U$13.C3 75.09,147.99 79.01,144.07 91.71,144.07 107.35,128.43 107.35,114.96 111.83,110.48 144.46,110.48 145.96,111.98 151.36,111.98 U$9.3
MDR_CHA
  Bottom 0.254: 169.81,56.27 169.81,59.48
  Bottom 0.4: 169.81,56.27 163.05,49.5 157.97,49.5 154.98,46.51 154.98,41.43 135.71,22.16 135.71,17.09 U$8.A6 | U$7.10 169.81,79.74 169.81,59.48
MDR_CHA\\
  Bottom 0.254: U$8.A5 137.62,16.99 136.54,18.06 136.31,18.29 136.31,19.98 136.31,20.22 136.51,20.43 | 172.36,56.27 172.36,59.48
  Bottom 0.4: 172.36,56.27 161,44.91 157.7,44.91 156.88,44.1 156.88,40.8 136.51,20.43 | U$7.11 172.36,79.75 172.36,59.48
MDR_CHB
  Bottom 0.254: U$8.A8 138.96,18.77 139.38,18.77 141.02,20.42
  Bottom 0.4: 141.02,20.42 159.83,39.22 160.39,39.22 162.71,41.54 162.71,43.86 174.97,56.13 174.97,79.82 U$7.12
MDR_CHB\\
  Bottom 0.4: U$8.A7 141.95,16.98 164.5,39.53 164.5,42.07 177.46,55.02 177.46,78.48 177.46,79.77 U$7.13
MDR_HS1
  Bottom 0.4: U$10.B1 131.95,33.11 131.95,55.47 149.46,72.98 157.46,72.98 163.46,78.98 U$7.7
MDR_HS2
  Bottom 0.4: U$10.B2 132.83,36.47 132.83,54.85 149.96,71.98 157.96,71.98 166,80.02 U$7.8
MDR_HS3
  Bottom 0.4: U$10.B3 134.01,39.55 134.01,54.52 150.46,70.98 158.51,70.98 161.01,73.48 U$7.9
MDR_MW1
  Bottom 1.27: U$14.C1 120.89,24.46 111.16,34.19 111.16,58.58 129.01,76.43 141.64,76.43 146.22,81.01 U$7.1
MDR_MW2
  Bottom 1.27: U$14.C2 113.81,35.62 113.81,57.41 130.58,74.18 145.17,74.18 150.76,79.78 U$7.2
MDR_MW3
  Bottom 1.27: U$14.C3 124.78,22.67 126.4,24.29 126.4,28.1 115.62,38.88 115.62,55.41 132.04,71.84 145.87,71.84 152.31,78.28 152.31,79.83 153.3,80.82 U$7.3
MDRB_DIR  (via drill 0.35)
  Top 0.4: U$7.14 171.8,59.98 169.46,59.98 158.96,70.48 158.96,75.48 157.46,76.98 v125.89,76.98 v125.89,76.99
  Route15 0.254: 174.87,81.98 174.87,80.38 173.96,79.48
  Route15 0.4: U$7.14 173.62,79.14 173.96,79.48 | 174.87,81.98 174.87,85.93 U$9.14
  Bottom 0.4: U$1.J3_5 73.75,67.21 116.11,67.21 v125.89,76.99
MDRB_PWM  (via drill 0.35, 0.35 pad 1)
  Top 0.4: R98.2 184.54,102.39 U2.2 181.65,102.39 181.06,102.98 181.06,104.18 181.82,104.93 U2.4 v182.47,106.57 v182.46,106.58 | U$9.17 166.02,80.46 v110.76,80.46
  Route15 0.254: 169.79,81.98 169.79,80.32 168.96,79.5
  Route15 0.4: U$1.J1_16 36.56,80.83 110.39,80.83 v110.76,80.46 | U$7.17 168.96,61.11 168.96,79.5 | 169.79,81.98 169.79,83.39 U$9.17
  Bottom 0.4: U$9.17 178.33,99.48 180.96,99.48 182.46,100.98 v182.46,106.58
MDRB_SPD
  Top 0.4: U$1.J3_4 61.76,55.22 R18.2 62.21,57.02 R19.1
MDRBF_SPD  (via drill 0.35)
  Top 0.254: 159.64,82.48 159.64,79.48
  Top 0.4: R18.1 62.88,59.98 v77.46,59.98 | MDRBF_OUT1.1 159.64,72.33 159.64,79.48 | 159.64,82.48 159.64,85.92 U$9.20
  Route15 0.4: v77.46,59.98 78.46,59.98 79.46,58.98 111.46,58.98 117.41,64.93 MDRBF_OUT1.1
MDRBR_SPD  (via drill 0.35)
  Top 0.4: R19.2 77.51,57.02 v80.46,59.98
  Route15 0.4: MDRBR_OUT1.1 166.38,73.11 123.1,73.11 113.31,63.32 83.81,63.32 v80.46,59.98
  Bottom 0.4: U$7.20 158.38,65.12 MDRBR_OUT1.1
N$1
  Top 0.4: DEBUG_B-.2 DEBUG_B+.3
N$2
  Top 0.4: R20.1 86.11,102.68 85.38,103.41 U$5.OUT2+ 85.38,111.54 U$5.OUT+
  Bottom 3.4: C19.1 123.86,95.41 C18.1 117.51,109.99 | C16.1 128.94,122.08 C17.1 117.51,122.08 117.51,109.99 | U$5.OUT+ 90.26,112.68 92.95,109.99 117.51,109.99
N$3
  Top 1.016: 150.74,52.18 151.55,52.18 F1.2
  Top 3.4: BATTERY_TERMINAL.P 148.86,52.18 150.74,52.18
N$4
  Top 0.4: Q1.G 176.34,91.6 174.46,93.48 170.75,97.19 R21.1
N$6
  Bottom 0.406: R22.1 40.16,53.96
  Bottom 0.61: 40.16,53.96 U$1.J3_13
N$10
  Top 0.4: BTN+.1 31.77,41.08 R1.2
N$11
  Bottom 0.4: MDRBR_OUT2.1 160.92,65.2 U$7.19
N$13
  Top 0.4: BTN-.1 39.65,34.06 R4.2
N$15
  Top 0.4: R13.2 U$1.J1_13
N$16
  Top 0.4: R71.2 37.5,54.08 U$1.J3_14
N$24
  Top 0.4: DEBUG_A-.2 57.78,36.36 50.17,43.97 DEBUG_A+.3
N$32  (via drill 0.35 pad 1)
  Top 1.27: DRIBLER_R_CONN.P 118.78,25.56 121.32,28.1 127.67,28.1 132.75,23.02 145.45,23.02 | v123.96,125.98 123.96,119.98 v125.46,118.48
  Top 2.032: Q1.S 183.55,96.68 189.14,91.09 189.14,66.71 145.45,23.02
  Bottom 1.27: Q1.S 181.66,96.68 184.46,99.48 184.46,109.48 180.96,112.98 133.46,112.98 129.96,116.48 127.46,116.48 v125.46,118.48 | DRIBLER_F_CONN.P 83.57,143.98 91.96,143.98 97.71,138.23 118.21,138.23 123.96,132.48 v123.96,125.98
N$35
  Top 0.4: R10.2 U$1.J1_14
N$36
  Top 0.4: R7.2 U$1.J3_15 | U$1.J3_15
N$51
  Top 0.4: U2.5 176.97,104.98 175.09,104.98 174.46,104.98 173.96,104.48 173.96,102.42 | R21.2 173.96,102.42 | 173.96,102.42 176.99,102.42 U2.7
N$52
  Top 0.254: 162.22,82.48 162.22,79.48
  Top 0.4: U$9.19 162.22,85.88 162.22,82.48 | 162.22,79.48 162.22,72.29 MDRBF_OUT2.1
SCL
  Top 0.254: 101,70.94 101,74.17 100.2,74.98
  Top 0.4: R16.2 U$1.J1_15 | IR_I2C.2 107.35,65.59 105.63,67.31 103.7,67.31 BNO055.5 102.27,69.67 101,70.94 | 100.2,74.98 96.46,74.98 94.65,76.79 MPU-6050.3 94.65,80.29 90.46,84.48 90.46,97.48 92.46,99.48 92.46,116.08 PIXY_FRONT.5
  Route15 0.4: MPU-6050.3 94.65,78.79 93.46,79.98 36.96,79.98 35.09,78.1 U$1.J1_15
  Bottom 0.4: U$1.J1_15 35.09,78.54 28.61,85.02 DISPLAY.3 | PIXY_REAR.5 80.84,37.98 95.96,37.98 103.96,45.98 103.96,51.98 109.46,57.48 109.46,62.82 IR_I2C.2
SDA  (via drill 0.35)
  Top 0.254: 93.27,93.48 93.4,93.6 93.4,97.35 93.27,97.48
  Top 0.4: R17.2 U$1.J1_12 42.71,82.31 34.05,90.98 28.46,90.98 26.07,88.59 DISPLAY.4 | IR_I2C.1 103.54,64.93 BNO055.4 99.73,72.48 | 99.73,72.48 ICM-20948.CL | ICM-20948.DA 99.66,72.55 99.73,72.48 | MPU-6050.4 97.19,80.75 93.27,84.67 93.27,93.48 | 93.27,97.48 93.27,111.81 PIXY_FRONT.9
  Route15 0.4: U$1.J1_12 44.87,78.98 v76.96,78.98
  Bottom 0.4: ICM-20948.DA 97.19,74.98 | 97.19,74.98 MPU-6050.4 | 97.19,74.98 88.96,74.98 84.96,78.98 v76.96,78.98 | PIXY_REAR.9 95.21,39.72 102.81,47.33 102.81,62.93 IR_I2C.1